# EAGLE schematic vr98-north-revA (EAGLE 9.6.2)

## Sheet 1 of 3
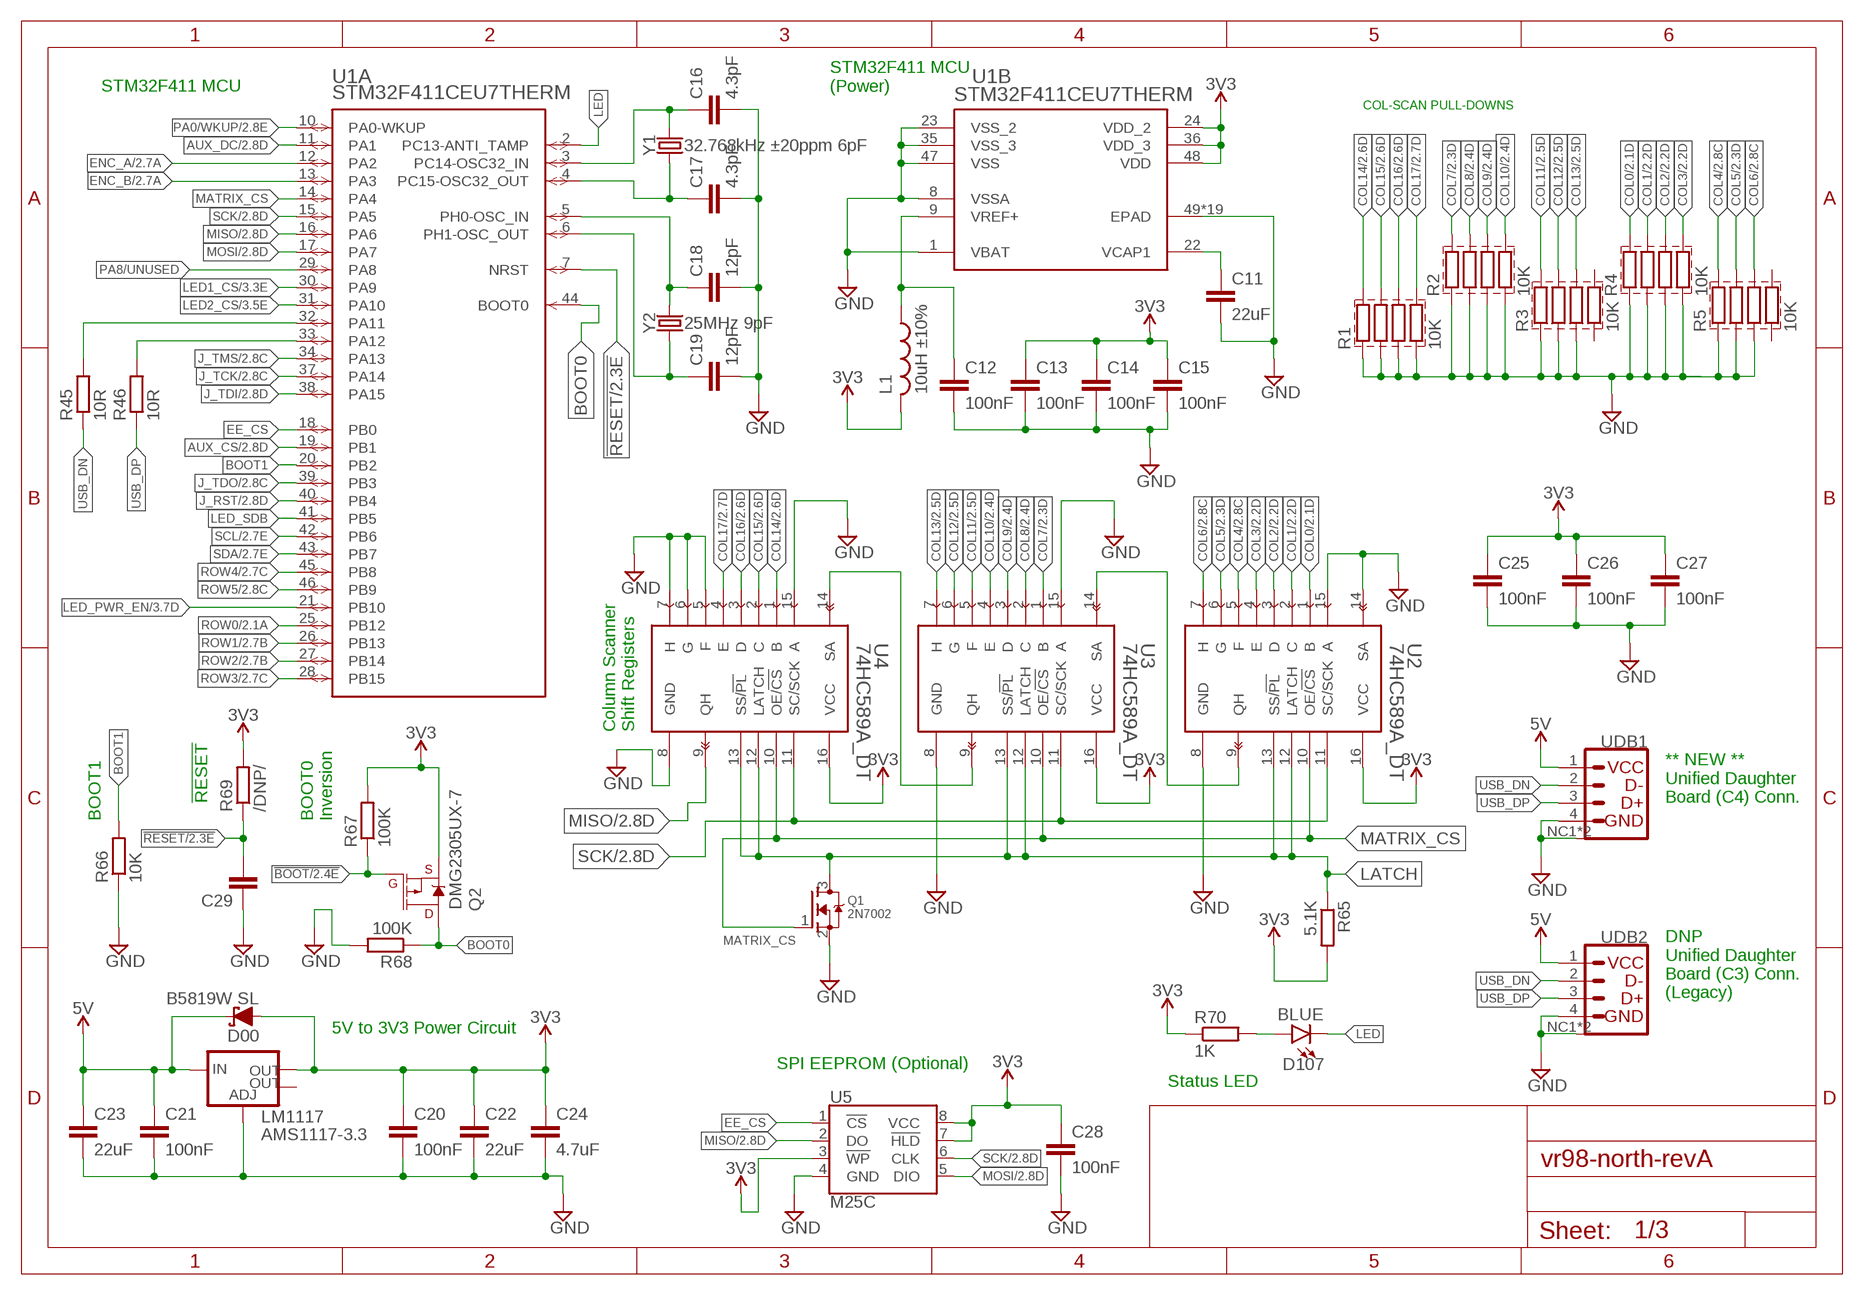
[diagram p0: schematic, sheet 1]

### Parts
C11  22uF  C-EUC0603  [C0603]
C12  100nF  C-EUC0603  [C0603]
C13  100nF  C-EUC0603  [C0603]
C14  100nF  C-EUC0603  [C0603]
C15  100nF  C-EUC0603  [C0603]
C16  4.3pF  C-EUC0603  [C0603]
C17  4.3pF  C-EUC0603  [C0603]
C18  12pF  C-EUC0603  [C0603]
C19  12pF  C-EUC0603  [C0603]
C20  100nF  0.1UF-0603-25V-5%  [0603]
C21  100nF  0.1UF-0603-25V-5%  [0603]
C22  22uF  0.22UF-0603-25V-10%  [0603]
C23  22uF  0.22UF-0603-25V-10%  [0603]
C24  4.7uF  1.0NF/1000PF-0603-50V-10%  [0603]
C25  100nF  0.1UF-0603-25V-5%  [0603]
C26  100nF  0.1UF-0603-25V-5%  [0603]
C27  100nF  0.1UF-0603-25V-5%  [0603]
C28  100nF  0.1UF-0603-25V-5%  [0603]
C29  C-EUC0603  [C0603]
D00  B5819W SL  1N5819WS  [SOD-123]
D107  BLUE  LED-BLUE0603  [LED-0603]
L1  10uH ±10%  L-USL3225M  [L3225M]
LM1117  AMS1117-3.3  V_REG_LM1117SOT223  [SOT223]
Q1  2N7002  MOSFET-NREFLOW  [SOT23]
Q2  DMG2305UX-7  MOSFET_PCH-DMG2305UX-7  [SOT23-3]
R1  10K  R-EU-4  [R0603X4]
R2  10K  R-EU-4  [R0603X4]
R3  10K  R-EU-4  [R0603X4]
R4  10K  R-EU-4  [R0603X4]
R5  10K  R-EU-4  [R0603X4]
R45  10R  R-EU_R0603  [R0603]
R46  10R  R-EU_R0603  [R0603]
R65  5.1K  R-EU_R0603  [R0603]
R66  10K  R-EU_R0603  [R0603]
R67  100K  R-EU_R0603  [R0603]
R68  100K  R-EU_R0603  [R0603]
R69  /DNP/  R-EU_R0603  [R0603]
R70  1K  R-EU_R0603  [R0603]
U1  STM32F411CEU7THERM  [UFQFPN-48_7X7X0P55MM-THERM]
U2  74HC589A_DT  [TSSOP16]
U3  74HC589A_DT  [TSSOP16]
U4  74HC589A_DT  [TSSOP16]
U5  M25C  [8-SOIC]
UDB1  UBD-S1_C4  [MOLEX_781710004]
UDB2  UBD-C3  [JST_SM04B-SRSS-TB_LF_SN]
Y1  32.768kHz ±20ppm 6pF  CRYSTAL-32.768KHZSMD-3.2X1.5  [CRYSTAL-SMD-3.2X1.5MM]
Y2  25MHz 9pF  CRYSTAL-24MHZ"  [CRYSTAL-SMD-5X3.2-4PAD]

### Nets
!BOOT: Q2.1(G) R67.1 ; also sheet 2
!RESET: C29.2 R69.1 U1.7(A:NRST) ; also sheet 2
AUX_CS: U1.19(A:PB1) ; also sheet 2
AUX_DC: U1.11(A:PA1) ; also sheet 2
BOOT0: Q2.3(D) R68.1 U1.44(A:BOOT0)
BOOT1: R66.2 U1.20(A:PB2)
COL0: R4.8 U2.1(B) ; also sheet 2
COL1: R4.7 U2.2(C) ; also sheet 2
COL2: R4.6 U2.3(D) ; also sheet 2
COL3: R4.5 U2.4(E) ; also sheet 2
COL4: R5.8 U2.5(F) ; also sheet 2
COL5: R5.7 U2.6(G) ; also sheet 2
COL6: R5.6 U2.7(H) ; also sheet 2
COL7: R2.8 U3.1(B) ; also sheet 2
COL8: R2.7 U3.2(C) ; also sheet 2
COL9: R2.6 U3.3(D) ; also sheet 2
COL10: R2.5 U3.4(E) ; also sheet 2
COL11: R3.8 U3.5(F) ; also sheet 2
COL12: R3.7 U3.6(G) ; also sheet 2
COL13: R3.6 U3.7(H) ; also sheet 2
COL14: R1.8 U4.1(B) ; also sheet 2
COL15: R1.7 U4.2(C) ; also sheet 2
COL16: R1.6 U4.3(D) ; also sheet 2
COL17: R1.5 U4.4(E) ; also sheet 2
EE_CS: U1.18(A:PB0) U5.1(!CS)
ENC_A: U1.12(A:PA2) ; also sheet 2
ENC_B: U1.13(A:PA3) ; also sheet 2
GND: C11.2 C12.2 C13.2 C14.2 C15.2 C16.2 C17.2 C18.2 C19.2 C20.2 C21.2 C22.2 C23.2 C24.2 C25.2 C26.2 C27.2 C28.2 C29.1 LM1117.1(ADJ) R66.1 R68.2 U1.1(B:VBAT) U1.8(B:VSSA) U1.23(B:VSS_2) U1.35(B:VSS_3) U1.47(B:VSS) U1.49(B:EPAD) U1.49@1(B:EPAD) U1.49@2(B:EPAD) U1.49@3(B:EPAD) U1.49@4(B:EPAD) U1.49@5(B:EPAD) U1.49@6(B:EPAD) U1.49@7(B:EPAD) U1.49@8(B:EPAD) U1.49@9(B:EPAD) U1.49@10(B:EPAD) U1.49@11(B:EPAD) U1.49@12(B:EPAD) U1.49@13(B:EPAD) U1.49@14(B:EPAD) U1.49@15(B:EPAD) U1.49@16(B:EPAD) U1.49@17(B:EPAD) U1.49@18(B:EPAD) U2.8(GND) U2.14(SA) U2.15(A) U3.8(GND) U3.15(A) U4.5(F) U4.6(G) U4.7(H) U4.8(GND) U4.15(A) U5.4(GND) UDB1.4(GND) UDB1.NC1(M) UDB1.NC2(M) UDB2.4(GND) UDB2.NC1(M) UDB2.NC2(M) ; also sheet 2,3
GND2: R1.1 R1.2 R1.3 R1.4 R2.1 R2.2 R2.3 R2.4 R3.1 R3.2 R3.3 R4.1 R4.2 R4.3 R4.4 R5.1 R5.2 R5.3 ; supply symbol labelled GND
J_RST: U1.40(A:PB4) ; also sheet 2
J_TCK: U1.37(A:PA14) ; also sheet 2
J_TDI: U1.38(A:PA15) ; also sheet 2
J_TDO: U1.39(A:PB3) ; also sheet 2
J_TMS: U1.34(A:PA13) ; also sheet 2
LATCH: Q1.3(D) R65.1 U2.12(LATCH) U2.13(SS/!PL) U3.12(LATCH) U3.13(SS/!PL) U4.12(LATCH) U4.13(SS/!PL)
LED: D107.C U1.2(A:PC13-ANTI_TAMP)
LED1_CS: U1.30(A:PA9) ; also sheet 3
LED2_CS: U1.31(A:PA10) ; also sheet 3
LED_PWR_EN: U1.21(A:PB10) ; also sheet 3
LED_SDB: U1.41(A:PB5)
MATRIX_CS: Q1.1(G) U1.14(A:PA4) U2.10(OE/!CS) U3.10(OE/!CS) U4.10(OE/!CS)
MISO: U1.16(A:PA6) U4.9(QH) U5.2(DO) ; also sheet 2,3
MOSI: U1.17(A:PA7) U5.5(DIO) ; also sheet 2,3
N$54: Q1.2(S) ; supply symbol labelled GND
N$75: C11.1 U1.22(B:VCAP1)
N$140: R45.2 U1.32(A:PA11)
N$141: R46.2 U1.33(A:PA12)
N$145: D107.A R70.2
N$149: U3.9(QH) U4.14(SA)
N$162: U2.9(QH) U3.14(SA)
PA0/WKUP: U1.10(A:PA0-WKUP) ; also sheet 2
PA8/UNUSED: U1.29(A:PA8)
ROW0: U1.25(A:PB12) ; also sheet 2
ROW1: U1.26(A:PB13) ; also sheet 2
ROW2: U1.27(A:PB14) ; also sheet 2
ROW3: U1.28(A:PB15) ; also sheet 2
ROW4: U1.45(A:PB8) ; also sheet 2
ROW5: U1.46(A:PB9) ; also sheet 2
SCK: U1.15(A:PA5) U2.11(SC/SCK) U3.11(SC/SCK) U4.11(SC/SCK) U5.6(CLK) ; also sheet 2,3
SCL: U1.42(A:PB6) ; also sheet 2,3
SDA: U1.43(A:PB7) ; also sheet 2,3
USB_DN: R45.1 UDB1.2(DN) UDB2.2(DN)
USB_DP: R46.1 UDB1.3(DP) UDB2.3(DP)
VCC_1: C21.1 C23.1 D00.C LM1117.3(IN) UDB1.1(VCC) UDB2.1(VCC) ; supply symbol labelled 5V ; also sheet 2,3
VCC_2: C13.1 C14.1 C15.1 C20.1 C22.1 C24.1 C25.1 C26.1 C27.1 C28.1 D00.A L1.2 LM1117.2(OUT) Q2.2(S) R65.2 R67.2 R69.2 R70.1 U1.24(B:VDD_2) U1.36(B:VDD_3) U1.48(B:VDD) U2.16(VCC) U3.16(VCC) U4.16(VCC) U5.3(!WP) U5.7(!HLD) U5.8(VCC) ; supply symbol labelled 3V3 ; also sheet 2,3
VREF+: C12.1 L1.1 U1.9(B:VREF+)
Y1I: C16.1 U1.3(A:PC14-OSC32_IN) Y1.P$2
Y1O: C17.1 U1.4(A:PC15-OSC32_OUT) Y1.P$1
Y2I: C18.1 U1.5(A:PH0-OSC_IN) Y2.3
Y2O: C19.1 U1.6(A:PH1-OSC_OUT) Y2.1
Unconnected: LM1117.4(OUT) R3.4 R3.5 R5.4 R5.5

### Notes on the sheet
- STM32F411 MCU
- STM32F411 MCU
  (Power)
- COL-SCAN PULL-DOWNS
- Column Scanner
  Shift Registers
- !RESET
- ** NEW **
  Unified Daughter
  Board (C4) Conn.
- BOOT1
- BOOT0
  Inversion
- DNP
  Unified Daughter
  Board (C3) Conn.
  (Legacy)
- 5V to 3V3 Power Circuit
- SPI EEPROM (Optional)
- Status LED

## Sheet 2 of 3
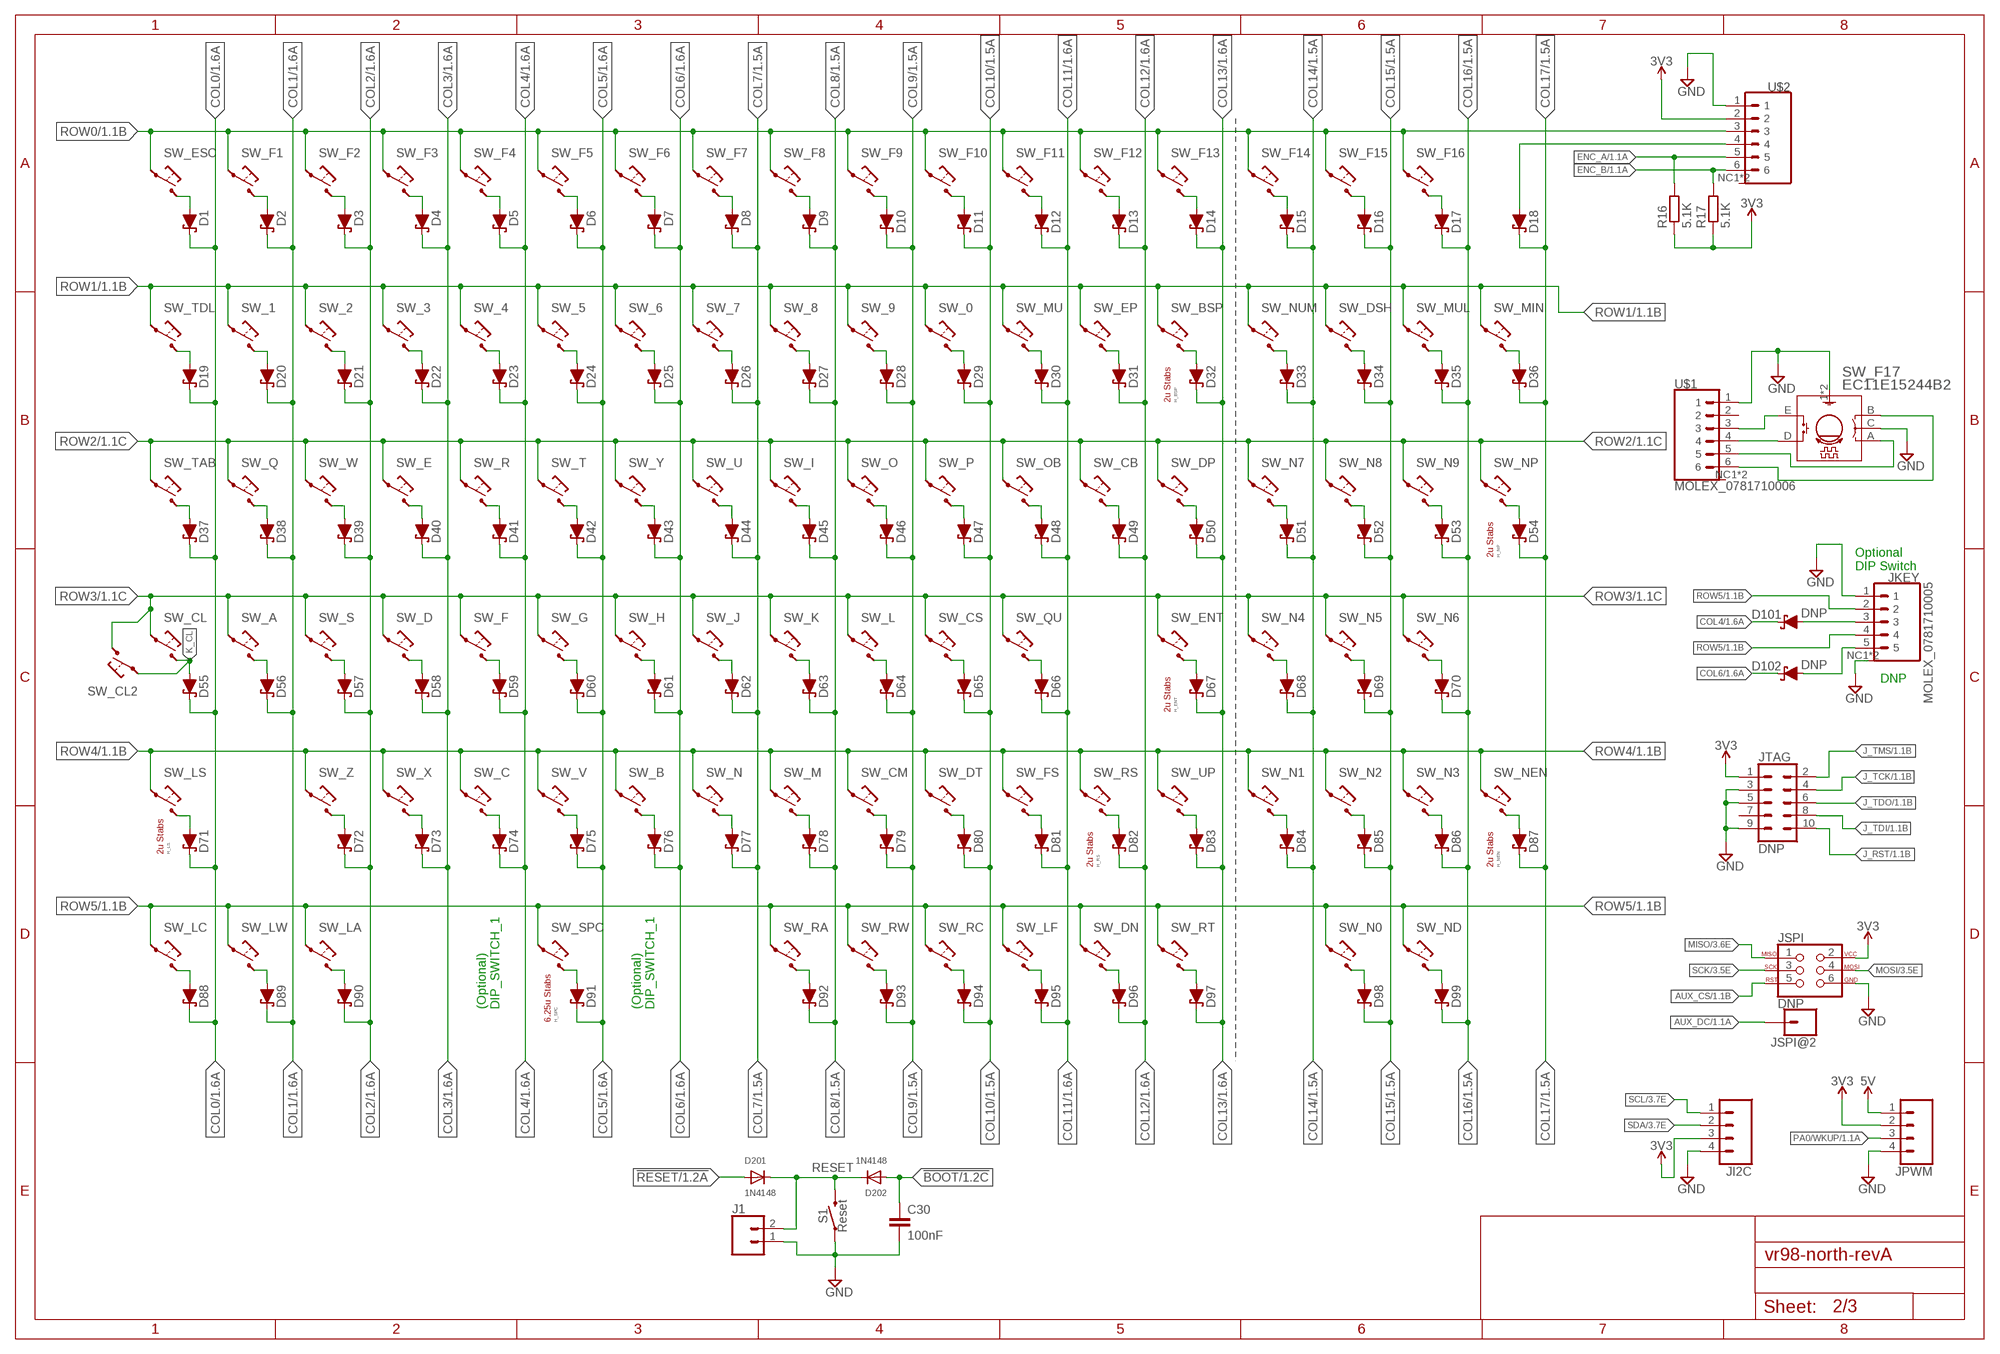
[diagram p1: schematic, sheet 2]

### Parts
C30  100nF  C-EUC0805  [C0805]
D1  1N5819WS  [SOD-123]
D2  1N5819WS  [SOD-123]
D3  1N5819WS  [SOD-123]
D4  1N5819WS  [SOD-123]
D5  1N5819WS  [SOD-123]
D6  1N5819WS  [SOD-123]
D7  1N5819WS  [SOD-123]
D8  1N5819WS  [SOD-123]
D9  1N5819WS  [SOD-123]
D10  1N5819WS  [SOD-123]
D11  1N5819WS  [SOD-123]
D12  1N5819WS  [SOD-123]
D13  1N5819WS  [SOD-123]
D14  1N5819WS  [SOD-123]
D15  1N5819WS  [SOD-123]
D16  1N5819WS  [SOD-123]
D17  1N5819WS  [SOD-123]
D18  1N5819WS  [SOD-123]
D19  1N5819WS  [SOD-123]
D20  1N5819WS  [SOD-123]
D21  1N5819WS  [SOD-123]
D22  1N5819WS  [SOD-123]
D23  1N5819WS  [SOD-123]
D24  1N5819WS  [SOD-123]
D25  1N5819WS  [SOD-123]
D26  1N5819WS  [SOD-123]
D27  1N5819WS  [SOD-123]
D28  1N5819WS  [SOD-123]
D29  1N5819WS  [SOD-123]
D30  1N5819WS  [SOD-123]
D31  1N5819WS  [SOD-123]
D32  1N5819WS  [SOD-123]
D33  1N5819WS  [SOD-123]
D34  1N5819WS  [SOD-123]
D35  1N5819WS  [SOD-123]
D36  1N5819WS  [SOD-123]
D37  1N5819WS  [SOD-123]
D38  1N5819WS  [SOD-123]
D39  1N5819WS  [SOD-123]
D40  1N5819WS  [SOD-123]
D41  1N5819WS  [SOD-123]
D42  1N5819WS  [SOD-123]
D43  1N5819WS  [SOD-123]
D44  1N5819WS  [SOD-123]
D45  1N5819WS  [SOD-123]
D46  1N5819WS  [SOD-123]
D47  1N5819WS  [SOD-123]
D48  1N5819WS  [SOD-123]
D49  1N5819WS  [SOD-123]
D50  1N5819WS  [SOD-123]
D51  1N5819WS  [SOD-123]
D52  1N5819WS  [SOD-123]
D53  1N5819WS  [SOD-123]
D54  1N5819WS  [SOD-123]
D55  1N5819WS  [SOD-123]
D56  1N5819WS  [SOD-123]
D57  1N5819WS  [SOD-123]
D58  1N5819WS  [SOD-123]
D59  1N5819WS  [SOD-123]
D60  1N5819WS  [SOD-123]
D61  1N5819WS  [SOD-123]
D62  1N5819WS  [SOD-123]
D63  1N5819WS  [SOD-123]
D64  1N5819WS  [SOD-123]
D65  1N5819WS  [SOD-123]
D66  1N5819WS  [SOD-123]
D67  1N5819WS  [SOD-123]
D68  1N5819WS  [SOD-123]
D69  1N5819WS  [SOD-123]
D70  1N5819WS  [SOD-123]
D71  1N5819WS  [SOD-123]
D72  1N5819WS  [SOD-123]
D73  1N5819WS  [SOD-123]
D74  1N5819WS  [SOD-123]
D75  1N5819WS  [SOD-123]
D76  1N5819WS  [SOD-123]
D77  1N5819WS  [SOD-123]
D78  1N5819WS  [SOD-123]
D79  1N5819WS  [SOD-123]
D80  1N5819WS  [SOD-123]
D81  1N5819WS  [SOD-123]
D82  1N5819WS  [SOD-123]
D83  1N5819WS  [SOD-123]
D84  1N5819WS  [SOD-123]
D85  1N5819WS  [SOD-123]
D86  1N5819WS  [SOD-123]
D87  1N5819WS  [SOD-123]
D88  1N5819WS  [SOD-123]
D89  1N5819WS  [SOD-123]
D90  1N5819WS  [SOD-123]
D91  1N5819WS  [SOD-123]
D92  1N5819WS  [SOD-123]
D93  1N5819WS  [SOD-123]
D94  1N5819WS  [SOD-123]
D95  1N5819WS  [SOD-123]
D96  1N5819WS  [SOD-123]
D97  1N5819WS  [SOD-123]
D98  1N5819WS  [SOD-123]
D99  1N5819WS  [SOD-123]
D101  DNP  1N5819WS  [SOD-123]
D102  DNP  1N5819WS  [SOD-123]
D201  1N4148  DIODESOT23_REFLOW  [SOT23-R]
D202  1N4148  DIODESOT23_REFLOW  [SOT23-R]
H_BSP  MX-STABS-200U  [MX-STABS-200U]
H_ENT  MX-STABS-200U  [MX-STABS-200U]
H_LS  MX-STABS-200U  [MX-STABS-200U]
H_NEN  MX-STABS-200U  [MX-STABS-200U]
H_NP  MX-STABS-200U  [MX-STABS-200U]
H_RS  MX-STABS-200U  [MX-STABS-200U]
H_SPC  MX-STABS-625U  [MX-STABS-625U]
J1  CONN_02  [1X02]
JI2C  CONN_04  [1X04]
JKEY  MOLEX_0781710005  [MOLEX_781710005]
JPWM  CONN_04  [1X04]
JSPI  DNP  AVR_SPI_PROG_3X2NS  [2X3-NS]
JSPI@2  CONN_01  [1X01]
JTAG  DNP  CONN_05X2NO_SILK  [2X5_NOSILK]
R16  5.1K  R-EU_R0603  [R0603]
R17  5.1K  R-EU_R0603  [R0603]
S1  Reset  MOMENTARY-SWITCH-SPST-SMD-5.2-TALL-REDUNDANT  [TACTILE_SWITCH_SMD_5.2MM]
SW_0  MX-5-PIN-HOTSWAP-PAD  [MX-5-PIN-HOTSWAP-PAD]
SW_1  MX-5-PIN-HOTSWAP-PAD  [MX-5-PIN-HOTSWAP-PAD]
SW_2  MX-5-PIN-HOTSWAP-PAD  [MX-5-PIN-HOTSWAP-PAD]
SW_3  MX-5-PIN-HOTSWAP-PAD  [MX-5-PIN-HOTSWAP-PAD]
SW_4  MX-5-PIN-HOTSWAP-PAD  [MX-5-PIN-HOTSWAP-PAD]
SW_5  MX-5-PIN-HOTSWAP-PAD  [MX-5-PIN-HOTSWAP-PAD]
SW_6  MX-5-PIN-HOTSWAP-PAD  [MX-5-PIN-HOTSWAP-PAD]
SW_7  MX-5-PIN-HOTSWAP-PAD  [MX-5-PIN-HOTSWAP-PAD]
SW_8  MX-5-PIN-HOTSWAP-PAD  [MX-5-PIN-HOTSWAP-PAD]
SW_9  MX-5-PIN-HOTSWAP-PAD  [MX-5-PIN-HOTSWAP-PAD]
SW_A  MX-5-PIN-HOTSWAP-PAD  [MX-5-PIN-HOTSWAP-PAD]
SW_B  MX-5-PIN-HOTSWAP-PAD  [MX-5-PIN-HOTSWAP-PAD]
SW_BSP  MX-5-PIN-HOTSWAP-PAD  [MX-5-PIN-HOTSWAP-PAD]
SW_C  MX-5-PIN-HOTSWAP-PAD  [MX-5-PIN-HOTSWAP-PAD]
SW_CB  MX-5-PIN-HOTSWAP-PAD  [MX-5-PIN-HOTSWAP-PAD]
SW_CL  MX-5-PIN-HOTSWAP-PAD  [MX-5-PIN-HOTSWAP-PAD]
SW_CL2  MX-5-PIN-MILMAX-3305-XNO-SILK  [MX-5-PIN-MILMAX-3305-X-NS]
SW_CM  MX-5-PIN-HOTSWAP-PAD  [MX-5-PIN-HOTSWAP-PAD]
SW_CS  MX-5-PIN-HOTSWAP-PAD  [MX-5-PIN-HOTSWAP-PAD]
SW_D  MX-5-PIN-HOTSWAP-PAD  [MX-5-PIN-HOTSWAP-PAD]
SW_DN  MX-5-PIN-HOTSWAP-PAD  [MX-5-PIN-HOTSWAP-PAD]
SW_DP  MX-5-PIN-HOTSWAP-PAD  [MX-5-PIN-HOTSWAP-PAD]
SW_DSH  MX-5-PIN-HOTSWAP-PAD  [MX-5-PIN-HOTSWAP-PAD]
SW_DT  MX-5-PIN-HOTSWAP-PAD  [MX-5-PIN-HOTSWAP-PAD]
SW_E  MX-5-PIN-HOTSWAP-PAD  [MX-5-PIN-HOTSWAP-PAD]
SW_ENT  MX-5-PIN-HOTSWAP-PAD  [MX-5-PIN-HOTSWAP-PAD]
SW_EP  MX-5-PIN-HOTSWAP-PAD  [MX-5-PIN-HOTSWAP-PAD]
SW_ESC  MX-5-PIN-HOTSWAP-PAD  [MX-5-PIN-HOTSWAP-PAD]
SW_F  MX-5-PIN-HOTSWAP-PAD  [MX-5-PIN-HOTSWAP-PAD]
SW_F1  MX-5-PIN-HOTSWAP-PAD  [MX-5-PIN-HOTSWAP-PAD]
SW_F2  MX-5-PIN-HOTSWAP-PAD  [MX-5-PIN-HOTSWAP-PAD]
SW_F3  MX-5-PIN-HOTSWAP-PAD  [MX-5-PIN-HOTSWAP-PAD]
SW_F4  MX-5-PIN-HOTSWAP-PAD  [MX-5-PIN-HOTSWAP-PAD]
SW_F5  MX-5-PIN-HOTSWAP-PAD  [MX-5-PIN-HOTSWAP-PAD]
SW_F6  MX-5-PIN-HOTSWAP-PAD  [MX-5-PIN-HOTSWAP-PAD]
SW_F7  MX-5-PIN-HOTSWAP-PAD  [MX-5-PIN-HOTSWAP-PAD]
SW_F8  MX-5-PIN-HOTSWAP-PAD  [MX-5-PIN-HOTSWAP-PAD]
SW_F9  MX-5-PIN-HOTSWAP-PAD  [MX-5-PIN-HOTSWAP-PAD]
SW_F10  MX-5-PIN-HOTSWAP-PAD  [MX-5-PIN-HOTSWAP-PAD]
SW_F11  MX-5-PIN-HOTSWAP-PAD  [MX-5-PIN-HOTSWAP-PAD]
SW_F12  MX-5-PIN-HOTSWAP-PAD  [MX-5-PIN-HOTSWAP-PAD]
SW_F13  MX-5-PIN-HOTSWAP-PAD  [MX-5-PIN-HOTSWAP-PAD]
SW_F14  MX-5-PIN-HOTSWAP-PAD  [MX-5-PIN-HOTSWAP-PAD]
SW_F15  MX-5-PIN-HOTSWAP-PAD  [MX-5-PIN-HOTSWAP-PAD]
SW_F16  MX-5-PIN-HOTSWAP-PAD  [MX-5-PIN-HOTSWAP-PAD]
SW_F17  EC11E15244B2  [ROTARY_EC11E]
SW_FS  MX-5-PIN-HOTSWAP-PAD  [MX-5-PIN-HOTSWAP-PAD]
SW_G  MX-5-PIN-HOTSWAP-PAD  [MX-5-PIN-HOTSWAP-PAD]
SW_H  MX-5-PIN-HOTSWAP-PAD  [MX-5-PIN-HOTSWAP-PAD]
SW_I  MX-5-PIN-HOTSWAP-PAD  [MX-5-PIN-HOTSWAP-PAD]
SW_J  MX-5-PIN-HOTSWAP-PAD  [MX-5-PIN-HOTSWAP-PAD]
SW_K  MX-5-PIN-HOTSWAP-PAD  [MX-5-PIN-HOTSWAP-PAD]
SW_L  MX-5-PIN-HOTSWAP-PAD  [MX-5-PIN-HOTSWAP-PAD]
SW_LA  MX-5-PIN-HOTSWAP-PAD  [MX-5-PIN-HOTSWAP-PAD]
SW_LC  MX-5-PIN-HOTSWAP-PAD  [MX-5-PIN-HOTSWAP-PAD]
SW_LF  MX-5-PIN-HOTSWAP-PAD  [MX-5-PIN-HOTSWAP-PAD]
SW_LS  MX-5-PIN-HOTSWAP-PAD  [MX-5-PIN-HOTSWAP-PAD]
SW_LW  MX-5-PIN-HOTSWAP-PAD  [MX-5-PIN-HOTSWAP-PAD]
SW_M  MX-5-PIN-HOTSWAP-PAD  [MX-5-PIN-HOTSWAP-PAD]
SW_MIN  MX-5-PIN-HOTSWAP-PAD  [MX-5-PIN-HOTSWAP-PAD]
SW_MU  MX-5-PIN-HOTSWAP-PAD  [MX-5-PIN-HOTSWAP-PAD]
SW_MUL  MX-5-PIN-HOTSWAP-PAD  [MX-5-PIN-HOTSWAP-PAD]
SW_N  MX-5-PIN-HOTSWAP-PAD  [MX-5-PIN-HOTSWAP-PAD]
SW_N0  MX-5-PIN-HOTSWAP-PAD  [MX-5-PIN-HOTSWAP-PAD]
SW_N1  MX-5-PIN-HOTSWAP-PAD  [MX-5-PIN-HOTSWAP-PAD]
SW_N2  MX-5-PIN-HOTSWAP-PAD  [MX-5-PIN-HOTSWAP-PAD]
SW_N3  MX-5-PIN-HOTSWAP-PAD  [MX-5-PIN-HOTSWAP-PAD]
SW_N4  MX-5-PIN-HOTSWAP-PAD  [MX-5-PIN-HOTSWAP-PAD]
SW_N5  MX-5-PIN-HOTSWAP-PAD  [MX-5-PIN-HOTSWAP-PAD]
SW_N6  MX-5-PIN-HOTSWAP-PAD  [MX-5-PIN-HOTSWAP-PAD]
SW_N7  MX-5-PIN-HOTSWAP-PAD  [MX-5-PIN-HOTSWAP-PAD]
SW_N8  MX-5-PIN-HOTSWAP-PAD  [MX-5-PIN-HOTSWAP-PAD]
SW_N9  MX-5-PIN-HOTSWAP-PAD  [MX-5-PIN-HOTSWAP-PAD]
SW_ND  MX-5-PIN-HOTSWAP-PAD  [MX-5-PIN-HOTSWAP-PAD]
SW_NEN  MX-5-PIN-HOTSWAP-PAD  [MX-5-PIN-HOTSWAP-PAD]
SW_NP  MX-5-PIN-HOTSWAP-PAD  [MX-5-PIN-HOTSWAP-PAD]
SW_NUM  MX-5-PIN-HOTSWAP-PAD  [MX-5-PIN-HOTSWAP-PAD]
SW_O  MX-5-PIN-HOTSWAP-PAD  [MX-5-PIN-HOTSWAP-PAD]
SW_OB  MX-5-PIN-HOTSWAP-PAD  [MX-5-PIN-HOTSWAP-PAD]
SW_P  MX-5-PIN-HOTSWAP-PAD  [MX-5-PIN-HOTSWAP-PAD]
SW_Q  MX-5-PIN-HOTSWAP-PAD  [MX-5-PIN-HOTSWAP-PAD]
SW_QU  MX-5-PIN-HOTSWAP-PAD  [MX-5-PIN-HOTSWAP-PAD]
SW_R  MX-5-PIN-HOTSWAP-PAD  [MX-5-PIN-HOTSWAP-PAD]
SW_RA  MX-5-PIN-HOTSWAP-PAD  [MX-5-PIN-HOTSWAP-PAD]
SW_RC  MX-5-PIN-HOTSWAP-PAD  [MX-5-PIN-HOTSWAP-PAD]
SW_RS  MX-5-PIN-HOTSWAP-PAD  [MX-5-PIN-HOTSWAP-PAD]
SW_RT  MX-5-PIN-HOTSWAP-PAD  [MX-5-PIN-HOTSWAP-PAD]
SW_RW  MX-5-PIN-HOTSWAP-PAD  [MX-5-PIN-HOTSWAP-PAD]
SW_S  MX-5-PIN-HOTSWAP-PAD  [MX-5-PIN-HOTSWAP-PAD]
SW_SPC  MX-5-PIN-HOTSWAP-PAD  [MX-5-PIN-HOTSWAP-PAD]
SW_T  MX-5-PIN-HOTSWAP-PAD  [MX-5-PIN-HOTSWAP-PAD]
SW_TAB  MX-5-PIN-HOTSWAP-PAD  [MX-5-PIN-HOTSWAP-PAD]
SW_TDL  MX-5-PIN-HOTSWAP-PAD  [MX-5-PIN-HOTSWAP-PAD]
SW_U  MX-5-PIN-HOTSWAP-PAD  [MX-5-PIN-HOTSWAP-PAD]
SW_UP  MX-5-PIN-HOTSWAP-PAD  [MX-5-PIN-HOTSWAP-PAD]
SW_V  MX-5-PIN-HOTSWAP-PAD  [MX-5-PIN-HOTSWAP-PAD]
SW_W  MX-5-PIN-HOTSWAP-PAD  [MX-5-PIN-HOTSWAP-PAD]
SW_X  MX-5-PIN-HOTSWAP-PAD  [MX-5-PIN-HOTSWAP-PAD]
SW_Y  MX-5-PIN-HOTSWAP-PAD  [MX-5-PIN-HOTSWAP-PAD]
SW_Z  MX-5-PIN-HOTSWAP-PAD  [MX-5-PIN-HOTSWAP-PAD]
U$1  MOLEX_0781710006  [MOLEX_781710006]
U$2  MOLEX_0781710006  [MOLEX_781710006]

### Nets
!BOOT: C30.1 D202.1(A) ; also sheet 1
!RESET: D201.1(A) ; also sheet 1
AUX_CS: JSPI.5 ; also sheet 1
AUX_DC: JSPI@2.1 ; also sheet 1
COL0: D1.C D19.C D37.C D55.C D71.C D88.C ; also sheet 1
COL1: D2.C D20.C D38.C D56.C D89.C ; also sheet 1
COL2: D3.C D21.C D39.C D57.C D72.C D90.C ; also sheet 1
COL3: D4.C D22.C D40.C D58.C D73.C ; also sheet 1
COL4: D5.C D23.C D41.C D59.C D74.C D101.C ; also sheet 1
COL5: D6.C D24.C D42.C D60.C D75.C D91.C ; also sheet 1
COL6: D7.C D25.C D43.C D61.C D76.C D102.C ; also sheet 1
COL7: D8.C D26.C D44.C D62.C D77.C ; also sheet 1
COL8: D9.C D27.C D45.C D63.C D78.C D92.C ; also sheet 1
COL9: D10.C D28.C D46.C D64.C D79.C D93.C ; also sheet 1
COL10: D11.C D29.C D47.C D65.C D80.C D94.C ; also sheet 1
COL11: D12.C D30.C D48.C D66.C D81.C D95.C ; also sheet 1
COL12: D13.C D31.C D49.C D82.C D96.C ; also sheet 1
COL13: D14.C D32.C D50.C D67.C D83.C D97.C ; also sheet 1
COL14: D15.C D33.C D51.C D68.C D84.C ; also sheet 1
COL15: D16.C D34.C D52.C D69.C D85.C D98.C ; also sheet 1
COL16: D17.C D35.C D53.C D70.C D86.C D99.C ; also sheet 1
COL17: D18.C D36.C D54.C D87.C ; also sheet 1
ENC_A: R16.2 U$2.5 ; also sheet 1
ENC_B: R17.2 U$2.6 ; also sheet 1
GND: C30.2 J1.1 JI2C.4 JKEY.1 JKEY.NC1(M) JKEY.NC2(M) JPWM.4 JSPI.6 JTAG.3 JTAG.5 JTAG.9 S1.1 S1.2 SW_F17.1(GND) SW_F17.2(GND) U$1.1 U$2.1 ; also sheet 1,3
J_RST: JTAG.10 ; also sheet 1
J_TCK: JTAG.4 ; also sheet 1
J_TDI: JTAG.8 ; also sheet 1
J_TDO: JTAG.6 ; also sheet 1
J_TMS: JTAG.2 ; also sheet 1
K_BSP: D32.A SW_BSP.1@1(P) SW_BSP.1@2(P)
K_CL: D55.A SW_CL2.2(S) SW_CL.1@1(P) SW_CL.1@2(P)
K_DP: D50.A SW_DP.1@1(P) SW_DP.1@2(P)
K_ENT: D67.A SW_ENT.1@1(P) SW_ENT.1@2(P)
K_LS: D71.A SW_LS.1@1(P) SW_LS.1@2(P)
MISO: JSPI.1 ; also sheet 1,3
MOSI: JSPI.4 ; also sheet 1,3
N$2: D70.A SW_N6.1@1(P) SW_N6.1@2(P)
N$25: D1.A SW_ESC.1@1(P) SW_ESC.1@2(P)
N$26: D2.A SW_F1.1@1(P) SW_F1.1@2(P)
N$27: D3.A SW_F2.1@1(P) SW_F2.1@2(P)
N$28: D4.A SW_F3.1@1(P) SW_F3.1@2(P)
N$29: D5.A SW_F4.1@1(P) SW_F4.1@2(P)
N$30: D6.A SW_F5.1@1(P) SW_F5.1@2(P)
N$31: D7.A SW_F6.1@1(P) SW_F6.1@2(P)
N$32: D8.A SW_F7.1@1(P) SW_F7.1@2(P)
N$33: D9.A SW_F8.1@1(P) SW_F8.1@2(P)
N$34: D10.A SW_F9.1@1(P) SW_F9.1@2(P)
N$35: D11.A SW_F10.1@1(P) SW_F10.1@2(P)
N$36: D12.A SW_F11.1@1(P) SW_F11.1@2(P)
N$37: D13.A SW_F12.1@1(P) SW_F12.1@2(P)
N$38: D14.A SW_F13.1@1(P) SW_F13.1@2(P)
N$39: D15.A SW_F14.1@1(P) SW_F14.1@2(P)
N$40: D16.A SW_F15.1@1(P) SW_F15.1@2(P)
N$41: D19.A SW_TDL.1@1(P) SW_TDL.1@2(P)
N$42: D20.A SW_1.1@1(P) SW_1.1@2(P)
N$43: D21.A SW_2.1@1(P) SW_2.1@2(P)
N$44: D22.A SW_3.1@1(P) SW_3.1@2(P)
N$45: D23.A SW_4.1@1(P) SW_4.1@2(P)
N$46: D24.A SW_5.1@1(P) SW_5.1@2(P)
N$47: D25.A SW_6.1@1(P) SW_6.1@2(P)
N$48: D26.A SW_7.1@1(P) SW_7.1@2(P)
N$49: D27.A SW_8.1@1(P) SW_8.1@2(P)
N$50: D28.A SW_9.1@1(P) SW_9.1@2(P)
N$51: D29.A SW_0.1@1(P) SW_0.1@2(P)
N$52: D30.A SW_MU.1@1(P) SW_MU.1@2(P)
N$53: D31.A SW_EP.1@1(P) SW_EP.1@2(P)
N$55: D33.A SW_NUM.1@1(P) SW_NUM.1@2(P)
N$56: D34.A SW_DSH.1@1(P) SW_DSH.1@2(P)
N$57: D38.A SW_Q.1@1(P) SW_Q.1@2(P)
N$58: D37.A SW_TAB.1@1(P) SW_TAB.1@2(P)
N$59: D39.A SW_W.1@1(P) SW_W.1@2(P)
N$60: D40.A SW_E.1@1(P) SW_E.1@2(P)
N$61: D41.A SW_R.1@1(P) SW_R.1@2(P)
N$62: D42.A SW_T.1@1(P) SW_T.1@2(P)
N$63: D43.A SW_Y.1@1(P) SW_Y.1@2(P)
N$64: D44.A SW_U.1@1(P) SW_U.1@2(P)
N$65: D45.A SW_I.1@1(P) SW_I.1@2(P)
N$66: D46.A SW_O.1@1(P) SW_O.1@2(P)
N$67: D47.A SW_P.1@1(P) SW_P.1@2(P)
N$68: D48.A SW_OB.1@1(P) SW_OB.1@2(P)
N$69: D49.A SW_CB.1@1(P) SW_CB.1@2(P)
N$71: D51.A SW_N7.1@1(P) SW_N7.1@2(P)
N$72: D52.A SW_N8.1@1(P) SW_N8.1@2(P)
N$73: D69.A SW_N5.1@1(P) SW_N5.1@2(P)
N$74: D68.A SW_N4.1@1(P) SW_N4.1@2(P)
N$76: D66.A SW_QU.1@1(P) SW_QU.1@2(P)
N$77: D65.A SW_CS.1@1(P) SW_CS.1@2(P)
N$78: D64.A SW_L.1@1(P) SW_L.1@2(P)
N$80: D56.A SW_A.1@1(P) SW_A.1@2(P)
N$81: D57.A SW_S.1@1(P) SW_S.1@2(P)
N$82: D58.A SW_D.1@1(P) SW_D.1@2(P)
N$83: D59.A SW_F.1@1(P) SW_F.1@2(P)
N$84: D60.A SW_G.1@1(P) SW_G.1@2(P)
N$85: D61.A SW_H.1@1(P) SW_H.1@2(P)
N$86: D62.A SW_J.1@1(P) SW_J.1@2(P)
N$87: D63.A SW_K.1@1(P) SW_K.1@2(P)
N$88: D72.A SW_Z.1@1(P) SW_Z.1@2(P)
N$89: D73.A SW_X.1@1(P) SW_X.1@2(P)
N$90: D74.A SW_C.1@1(P) SW_C.1@2(P)
N$91: D75.A SW_V.1@1(P) SW_V.1@2(P)
N$92: D76.A SW_B.1@1(P) SW_B.1@2(P)
N$93: D77.A SW_N.1@1(P) SW_N.1@2(P)
N$94: D78.A SW_M.1@1(P) SW_M.1@2(P)
N$95: D79.A SW_CM.1@1(P) SW_CM.1@2(P)
N$96: D80.A SW_DT.1@1(P) SW_DT.1@2(P)
N$97: D81.A SW_FS.1@1(P) SW_FS.1@2(P)
N$98: D82.A SW_RS.1@1(P) SW_RS.1@2(P)
N$99: D83.A SW_UP.1@1(P) SW_UP.1@2(P)
N$100: D84.A SW_N1.1@1(P) SW_N1.1@2(P)
N$101: D85.A SW_N2.1@1(P) SW_N2.1@2(P)
N$102: D98.A SW_N0.1@1(P) SW_N0.1@2(P)
N$103: D97.A SW_RT.1@1(P) SW_RT.1@2(P)
N$104: D96.A SW_DN.1@1(P) SW_DN.1@2(P)
N$105: D95.A SW_LF.1@1(P) SW_LF.1@2(P)
N$106: SW_F17.E U$1.3
N$107: D94.A SW_RC.1@1(P) SW_RC.1@2(P)
N$108: D93.A SW_RW.1@1(P) SW_RW.1@2(P)
N$109: D92.A SW_RA.1@1(P) SW_RA.1@2(P)
N$110: D91.A SW_SPC.1@1(P) SW_SPC.1@2(P)
N$111: D90.A SW_LA.1@1(P) SW_LA.1@2(P)
N$112: D89.A SW_LW.1@1(P) SW_LW.1@2(P)
N$113: D88.A SW_LC.1@1(P) SW_LC.1@2(P)
N$114: D99.A SW_ND.1@1(P) SW_ND.1@2(P)
N$115: D86.A SW_N3.1@1(P) SW_N3.1@2(P)
N$116: D87.A SW_NEN.1@1(P) SW_NEN.1@2(P)
N$117: D54.A SW_NP.1@1(P) SW_NP.1@2(P)
N$118: D53.A SW_N9.1@1(P) SW_N9.1@2(P)
N$119: D36.A SW_MIN.1@1(P) SW_MIN.1@2(P)
N$120: D35.A SW_MUL.1@1(P) SW_MUL.1@2(P)
N$121: D17.A SW_F16.1@1(P) SW_F16.1@2(P)
N$142: SW_F17.D U$1.4
N$144: D101.A JKEY.3
N$152: SW_F17.A U$1.5
N$154: SW_F17.B U$1.6
N$155: SW_F17.C ; supply symbol labelled GND
N$156: D102.A JKEY.5
N$157: D18.A U$2.4
PA0/WKUP: JPWM.3 ; also sheet 1
RESET: D201.3(C) D202.3(C) J1.2 S1.3 S1.4
ROW0: SW_ESC.2@1(S) SW_ESC.2@2(S) SW_F1.2@1(S) SW_F1.2@2(S) SW_F2.2@1(S) SW_F2.2@2(S) SW_F3.2@1(S) SW_F3.2@2(S) SW_F4.2@1(S) SW_F4.2@2(S) SW_F5.2@1(S) SW_F5.2@2(S) SW_F6.2@1(S) SW_F6.2@2(S) SW_F7.2@1(S) SW_F7.2@2(S) SW_F8.2@1(S) SW_F8.2@2(S) SW_F9.2@1(S) SW_F9.2@2(S) SW_F10.2@1(S) SW_F10.2@2(S) SW_F11.2@1(S) SW_F11.2@2(S) SW_F12.2@1(S) SW_F12.2@2(S) SW_F13.2@1(S) SW_F13.2@2(S) SW_F14.2@1(S) SW_F14.2@2(S) SW_F15.2@1(S) SW_F15.2@2(S) SW_F16.2@1(S) SW_F16.2@2(S) U$2.3 ; also sheet 1
ROW1: SW_0.2@1(S) SW_0.2@2(S) SW_1.2@1(S) SW_1.2@2(S) SW_2.2@1(S) SW_2.2@2(S) SW_3.2@1(S) SW_3.2@2(S) SW_4.2@1(S) SW_4.2@2(S) SW_5.2@1(S) SW_5.2@2(S) SW_6.2@1(S) SW_6.2@2(S) SW_7.2@1(S) SW_7.2@2(S) SW_8.2@1(S) SW_8.2@2(S) SW_9.2@1(S) SW_9.2@2(S) SW_BSP.2@1(S) SW_BSP.2@2(S) SW_DSH.2@1(S) SW_DSH.2@2(S) SW_EP.2@1(S) SW_EP.2@2(S) SW_MIN.2@1(S) SW_MIN.2@2(S) SW_MU.2@1(S) SW_MU.2@2(S) SW_MUL.2@1(S) SW_MUL.2@2(S) SW_NUM.2@1(S) SW_NUM.2@2(S) SW_TDL.2@1(S) SW_TDL.2@2(S) ; also sheet 1
ROW2: SW_CB.2@1(S) SW_CB.2@2(S) SW_DP.2@1(S) SW_DP.2@2(S) SW_E.2@1(S) SW_E.2@2(S) SW_I.2@1(S) SW_I.2@2(S) SW_N7.2@1(S) SW_N7.2@2(S) SW_N8.2@1(S) SW_N8.2@2(S) SW_N9.2@1(S) SW_N9.2@2(S) SW_NP.2@1(S) SW_NP.2@2(S) SW_O.2@1(S) SW_O.2@2(S) SW_OB.2@1(S) SW_OB.2@2(S) SW_P.2@1(S) SW_P.2@2(S) SW_Q.2@1(S) SW_Q.2@2(S) SW_R.2@1(S) SW_R.2@2(S) SW_T.2@1(S) SW_T.2@2(S) SW_TAB.2@1(S) SW_TAB.2@2(S) SW_U.2@1(S) SW_U.2@2(S) SW_W.2@1(S) SW_W.2@2(S) SW_Y.2@1(S) SW_Y.2@2(S) ; also sheet 1
ROW3: SW_A.2@1(S) SW_A.2@2(S) SW_CL2.1(P) SW_CL.2@1(S) SW_CL.2@2(S) SW_CS.2@1(S) SW_CS.2@2(S) SW_D.2@1(S) SW_D.2@2(S) SW_ENT.2@1(S) SW_ENT.2@2(S) SW_F.2@1(S) SW_F.2@2(S) SW_G.2@1(S) SW_G.2@2(S) SW_H.2@1(S) SW_H.2@2(S) SW_J.2@1(S) SW_J.2@2(S) SW_K.2@1(S) SW_K.2@2(S) SW_L.2@1(S) SW_L.2@2(S) SW_N4.2@1(S) SW_N4.2@2(S) SW_N5.2@1(S) SW_N5.2@2(S) SW_N6.2@1(S) SW_N6.2@2(S) SW_QU.2@1(S) SW_QU.2@2(S) SW_S.2@1(S) SW_S.2@2(S) ; also sheet 1
ROW4: SW_B.2@1(S) SW_B.2@2(S) SW_C.2@1(S) SW_C.2@2(S) SW_CM.2@1(S) SW_CM.2@2(S) SW_DT.2@1(S) SW_DT.2@2(S) SW_FS.2@1(S) SW_FS.2@2(S) SW_LS.2@1(S) SW_LS.2@2(S) SW_M.2@1(S) SW_M.2@2(S) SW_N1.2@1(S) SW_N1.2@2(S) SW_N2.2@1(S) SW_N2.2@2(S) SW_N3.2@1(S) SW_N3.2@2(S) SW_N.2@1(S) SW_N.2@2(S) SW_NEN.2@1(S) SW_NEN.2@2(S) SW_RS.2@1(S) SW_RS.2@2(S) SW_UP.2@1(S) SW_UP.2@2(S) SW_V.2@1(S) SW_V.2@2(S) SW_X.2@1(S) SW_X.2@2(S) SW_Z.2@1(S) SW_Z.2@2(S) ; also sheet 1
ROW5: JKEY.2 JKEY.4 SW_DN.2@1(S) SW_DN.2@2(S) SW_LA.2@1(S) SW_LA.2@2(S) SW_LC.2@1(S) SW_LC.2@2(S) SW_LF.2@1(S) SW_LF.2@2(S) SW_LW.2@1(S) SW_LW.2@2(S) SW_N0.2@1(S) SW_N0.2@2(S) SW_ND.2@1(S) SW_ND.2@2(S) SW_RA.2@1(S) SW_RA.2@2(S) SW_RC.2@1(S) SW_RC.2@2(S) SW_RT.2@1(S) SW_RT.2@2(S) SW_RW.2@1(S) SW_RW.2@2(S) SW_SPC.2@1(S) SW_SPC.2@2(S) ; also sheet 1
SCK: JSPI.3 ; also sheet 1,3
SCL: JI2C.1 ; also sheet 1,3
SDA: JI2C.2 ; also sheet 1,3
VCC_1: JPWM.1 ; supply symbol labelled 5V ; also sheet 1,3
VCC_2: JI2C.3 JPWM.2 JSPI.2 JTAG.1 R16.1 R17.1 U$2.2 ; supply symbol labelled 3V3 ; also sheet 1,3
Unconnected: JTAG.7 U$1.2 U$1.NC1(M) U$1.NC2(M) U$2.NC1(M) U$2.NC2(M)

### Notes on the sheet
- Optional
  DIP Switch
- DNP
- (Optional)
  DIP_SWITCH_1
- (Optional)
  DIP_SWITCH_1

## Sheet 3 of 3
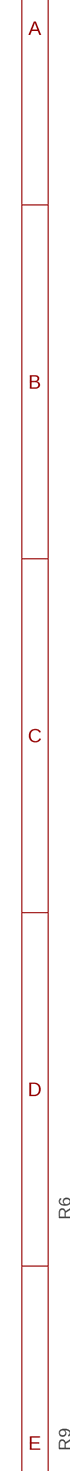
[diagram p2: schematic, sheet 3, part 1 of 2]
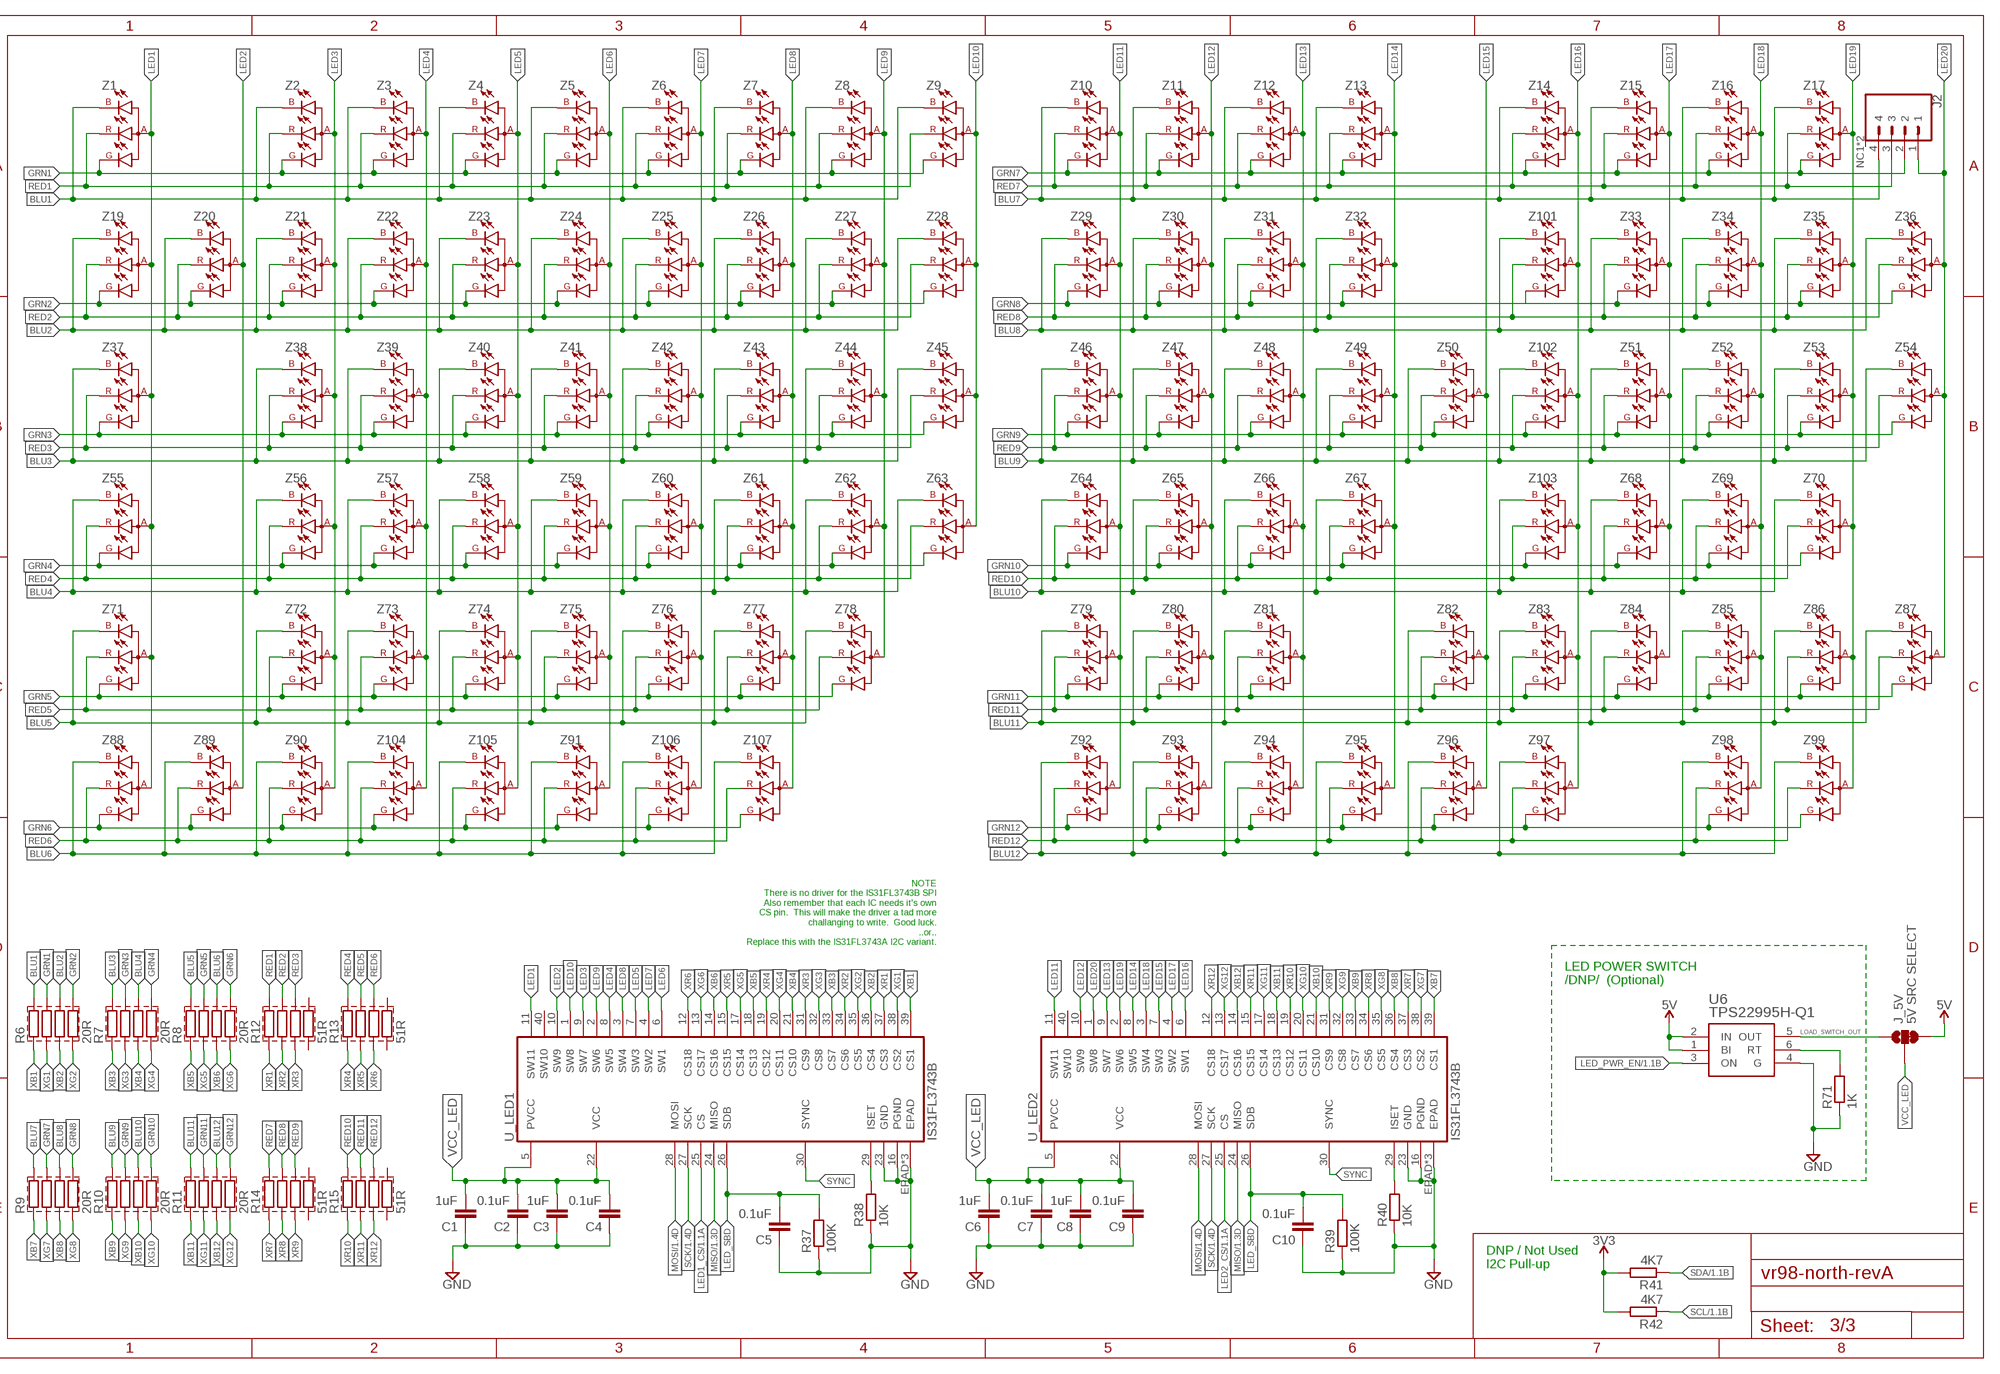
[diagram p3: schematic, sheet 3, part 2 of 2]

### Parts
C1  1uF  C-EUC0603  [C0603]
C2  0.1uF  C-EUC0603  [C0603]
C3  1uF  C-EUC0603  [C0603]
C4  0.1uF  C-EUC0603  [C0603]
C5  0.1uF  C-EUC0603  [C0603]
C6  1uF  C-EUC0603  [C0603]
C7  0.1uF  C-EUC0603  [C0603]
C8  1uF  C-EUC0603  [C0603]
C9  0.1uF  C-EUC0603  [C0603]
C10  0.1uF  C-EUC0603  [C0603]
J2  MOLEX_0781710004  [MOLEX_781710004]
J_5V  5V SRC SELECT  JUMPER-SMT_3_1-NC_TRACE_SILK  [SMT-JUMPER_3_1-NC_TRACE_SILK]
R6  20R  R-EU-4  [R0603X4]
R7  20R  R-EU-4  [R0603X4]
R8  20R  R-EU-4  [R0603X4]
R9  20R  R-EU-4  [R0603X4]
R10  20R  R-EU-4  [R0603X4]
R11  20R  R-EU-4  [R0603X4]
R12  51R  R-EU-4  [R0603X4]
R13  51R  R-EU-4  [R0603X4]
R14  51R  R-EU-4  [R0603X4]
R15  51R  R-EU-4  [R0603X4]
R37  100K  R-EU_R0603  [R0603]
R38  10K  R-EU_R0603  [R0603]
R39  100K  R-EU_R0603  [R0603]
R40  10K  R-EU_R0603  [R0603]
R41  4K7  R-EU_R0603  [R0603]
R42  4K7  R-EU_R0603  [R0603]
R71  1K  R-EU_R0603  [R0603]
U6  TPS22995H-Q1  [SOT-23-THIN-6_DDC_TEX]
U_LED1  IS31FL3743B  [UQFN40]
U_LED2  IS31FL3743B  [UQFN40]
Z1  156120M173000  [156120M173000]
Z2  156120M173000  [156120M173000]
Z3  156120M173000  [156120M173000]
Z4  156120M173000  [156120M173000]
Z5  156120M173000  [156120M173000]
Z6  156120M173000  [156120M173000]
Z7  156120M173000  [156120M173000]
Z8  156120M173000  [156120M173000]
Z9  156120M173000  [156120M173000]
Z10  156120M173000  [156120M173000]
Z11  156120M173000  [156120M173000]
Z12  156120M173000  [156120M173000]
Z13  156120M173000  [156120M173000]
Z14  156120M173000  [156120M173000]
Z15  156120M173000  [156120M173000]
Z16  156120M173000  [156120M173000]
Z17  156120M173000  [156120M173000]
Z19  DNP  156120M173000  [156120M173000]
Z20  156120M173000  [156120M173000]
Z21  156120M173000  [156120M173000]
Z22  156120M173000  [156120M173000]
Z23  156120M173000  [156120M173000]
Z24  156120M173000  [156120M173000]
Z25  156120M173000  [156120M173000]
Z26  156120M173000  [156120M173000]
Z27  156120M173000  [156120M173000]
Z28  156120M173000  [156120M173000]
Z29  156120M173000  [156120M173000]
Z30  156120M173000  [156120M173000]
Z31  156120M173000  [156120M173000]
Z32  156120M173000  [156120M173000]
Z33  156120M173000  [156120M173000]
Z34  156120M173000  [156120M173000]
Z35  156120M173000  [156120M173000]
Z36  156120M173000  [156120M173000]
Z37  156120M173000  [156120M173000]
Z38  156120M173000  [156120M173000]
Z39  156120M173000  [156120M173000]
Z40  156120M173000  [156120M173000]
Z41  156120M173000  [156120M173000]
Z42  156120M173000  [156120M173000]
Z43  156120M173000  [156120M173000]
Z44  156120M173000  [156120M173000]
Z45  156120M173000  [156120M173000]
Z46  156120M173000  [156120M173000]
Z47  156120M173000  [156120M173000]
Z48  156120M173000  [156120M173000]
Z49  156120M173000  [156120M173000]
Z50  156120M173000  [156120M173000]
Z51  156120M173000  [156120M173000]
Z52  156120M173000  [156120M173000]
Z53  156120M173000  [156120M173000]
Z54  156120M173000  [156120M173000]
Z55  156120M173000  [156120M173000]
Z56  156120M173000  [156120M173000]
Z57  156120M173000  [156120M173000]
Z58  156120M173000  [156120M173000]
Z59  156120M173000  [156120M173000]
Z60  156120M173000  [156120M173000]
Z61  156120M173000  [156120M173000]
Z62  156120M173000  [156120M173000]
Z63  156120M173000  [156120M173000]
Z64  156120M173000  [156120M173000]
Z65  156120M173000  [156120M173000]
Z66  156120M173000  [156120M173000]
Z67  156120M173000  [156120M173000]
Z68  156120M173000  [156120M173000]
Z69  156120M173000  [156120M173000]
Z70  156120M173000  [156120M173000]
Z71  156120M173000  [156120M173000]
Z72  156120M173000  [156120M173000]
Z73  156120M173000  [156120M173000]
Z74  156120M173000  [156120M173000]
Z75  156120M173000  [156120M173000]
Z76  156120M173000  [156120M173000]
Z77  156120M173000  [156120M173000]
Z78  156120M173000  [156120M173000]
Z79  156120M173000  [156120M173000]
Z80  156120M173000  [156120M173000]
Z81  156120M173000  [156120M173000]
Z82  156120M173000  [156120M173000]
Z83  156120M173000  [156120M173000]
Z84  156120M173000  [156120M173000]
Z85  156120M173000  [156120M173000]
Z86  156120M173000  [156120M173000]
Z87  156120M173000  [156120M173000]
Z88  156120M173000  [156120M173000]
Z89  156120M173000  [156120M173000]
Z90  156120M173000  [156120M173000]
Z91  156120M173000  [156120M173000]
Z92  156120M173000  [156120M173000]
Z93  156120M173000  [156120M173000]
Z94  156120M173000  [156120M173000]
Z95  156120M173000  [156120M173000]
Z96  156120M173000  [156120M173000]
Z97  156120M173000  [156120M173000]
Z98  156120M173000  [156120M173000]
Z99  156120M173000  [156120M173000]
Z101  156120M173000  [156120M173000]
Z102  156120M173000  [156120M173000]
Z103  156120M173000  [156120M173000]
Z104  156120M173000  [156120M173000]
Z105  156120M173000  [156120M173000]
Z106  156120M173000  [156120M173000]
Z107  156120M173000  [156120M173000]

### Nets
BLU1: R6.8 Z1.2(B) Z2.2(B) Z3.2(B) Z4.2(B) Z5.2(B) Z6.2(B) Z7.2(B) Z8.2(B) Z9.2(B)
BLU2: R6.6 Z19.2(B) Z20.2(B) Z21.2(B) Z22.2(B) Z23.2(B) Z24.2(B) Z25.2(B) Z26.2(B) Z27.2(B) Z28.2(B)
BLU3: R7.8 Z37.2(B) Z38.2(B) Z39.2(B) Z40.2(B) Z41.2(B) Z42.2(B) Z43.2(B) Z44.2(B) Z45.2(B)
BLU4: R7.6 Z55.2(B) Z56.2(B) Z57.2(B) Z58.2(B) Z59.2(B) Z60.2(B) Z61.2(B) Z62.2(B) Z63.2(B)
BLU5: R8.8 Z71.2(B) Z72.2(B) Z73.2(B) Z74.2(B) Z75.2(B) Z76.2(B) Z77.2(B) Z78.2(B)
BLU6: R8.6 Z88.2(B) Z89.2(B) Z90.2(B) Z91.2(B) Z104.2(B) Z105.2(B) Z106.2(B) Z107.2(B)
BLU7: J2.4 R9.8 Z10.2(B) Z11.2(B) Z12.2(B) Z13.2(B) Z14.2(B) Z15.2(B) Z16.2(B) Z17.2(B)
BLU8: R9.6 Z29.2(B) Z30.2(B) Z31.2(B) Z32.2(B) Z33.2(B) Z34.2(B) Z35.2(B) Z36.2(B) Z101.2(B)
BLU9: R10.8 Z46.2(B) Z47.2(B) Z48.2(B) Z49.2(B) Z50.2(B) Z51.2(B) Z52.2(B) Z53.2(B) Z54.2(B) Z102.2(B)
BLU10: R10.6 Z64.2(B) Z65.2(B) Z66.2(B) Z67.2(B) Z68.2(B) Z69.2(B) Z70.2(B) Z103.2(B)
BLU11: R11.8 Z79.2(B) Z80.2(B) Z81.2(B) Z82.2(B) Z83.2(B) Z84.2(B) Z85.2(B) Z86.2(B) Z87.2(B)
BLU12: R11.6 Z92.2(B) Z93.2(B) Z94.2(B) Z95.2(B) Z96.2(B) Z97.2(B) Z98.2(B) Z99.2(B)
GND: C1.1 C2.1 C3.1 C4.1 C5.1 C6.1 C7.1 C8.1 C9.1 C10.1 R37.1 R38.1 R39.1 R40.1 R71.1 U6.4(G) U_LED1.16(PGND) U_LED1.23(GND) U_LED1.EPAD U_LED1.EPAD@1(EPAD) U_LED1.EPAD@2(EPAD) U_LED2.16(PGND) U_LED2.23(GND) U_LED2.EPAD U_LED2.EPAD@1(EPAD) U_LED2.EPAD@2(EPAD) ; also sheet 1,2
GRN1: R6.7 Z1.4(G) Z2.4(G) Z3.4(G) Z4.4(G) Z5.4(G) Z6.4(G) Z7.4(G) Z8.4(G) Z9.4(G)
GRN2: R6.5 Z19.4(G) Z20.4(G) Z21.4(G) Z22.4(G) Z23.4(G) Z24.4(G) Z25.4(G) Z26.4(G) Z27.4(G) Z28.4(G)
GRN3: R7.7 Z37.4(G) Z38.4(G) Z39.4(G) Z40.4(G) Z41.4(G) Z42.4(G) Z43.4(G) Z44.4(G) Z45.4(G)
GRN4: R7.5 Z55.4(G) Z56.4(G) Z57.4(G) Z58.4(G) Z59.4(G) Z60.4(G) Z61.4(G) Z62.4(G) Z63.4(G)
GRN5: R8.7 Z71.4(G) Z72.4(G) Z73.4(G) Z74.4(G) Z75.4(G) Z76.4(G) Z77.4(G) Z78.4(G)
GRN6: R8.5 Z88.4(G) Z89.4(G) Z90.4(G) Z91.4(G) Z104.4(G) Z105.4(G) Z106.4(G) Z107.4(G)
GRN7: J2.2 R9.7 Z10.4(G) Z11.4(G) Z12.4(G) Z13.4(G) Z14.4(G) Z15.4(G) Z16.4(G) Z17.4(G)
GRN8: R9.5 Z29.4(G) Z30.4(G) Z31.4(G) Z32.4(G) Z33.4(G) Z34.4(G) Z35.4(G) Z36.4(G) Z101.4(G)
GRN9: R10.7 Z46.4(G) Z47.4(G) Z48.4(G) Z49.4(G) Z50.4(G) Z51.4(G) Z52.4(G) Z53.4(G) Z54.4(G) Z102.4(G)
GRN10: R10.5 Z64.4(G) Z65.4(G) Z66.4(G) Z67.4(G) Z68.4(G) Z69.4(G) Z70.4(G) Z103.4(G)
GRN11: R11.7 Z79.4(G) Z80.4(G) Z81.4(G) Z82.4(G) Z83.4(G) Z84.4(G) Z85.4(G) Z86.4(G) Z87.4(G)
GRN12: R11.5 Z92.4(G) Z93.4(G) Z94.4(G) Z95.4(G) Z96.4(G) Z97.4(G) Z98.4(G) Z99.4(G)
LED1: U_LED1.11(SW11) Z1.1(A) Z19.1(A) Z37.1(A) Z55.1(A) Z71.1(A) Z88.1(A)
LED1_CS: U_LED1.25(CS) ; also sheet 1
LED2: U_LED1.10(SW9) Z20.1(A) Z89.1(A)
LED2_CS: U_LED2.25(CS) ; also sheet 1
LED3: U_LED1.9(SW7) Z2.1(A) Z21.1(A) Z38.1(A) Z56.1(A) Z72.1(A) Z90.1(A)
LED4: U_LED1.8(SW5) Z3.1(A) Z22.1(A) Z39.1(A) Z57.1(A) Z73.1(A) Z104.1(A)
LED5: U_LED1.7(SW3) Z4.1(A) Z23.1(A) Z40.1(A) Z58.1(A) Z74.1(A) Z105.1(A)
LED6: U_LED1.6(SW1) Z5.1(A) Z24.1(A) Z41.1(A) Z59.1(A) Z75.1(A) Z91.1(A)
LED7: U_LED1.4(SW2) Z6.1(A) Z25.1(A) Z42.1(A) Z60.1(A) Z76.1(A) Z106.1(A)
LED8: U_LED1.3(SW4) Z7.1(A) Z26.1(A) Z43.1(A) Z61.1(A) Z77.1(A) Z107.1(A)
LED9: U_LED1.2(SW6) Z8.1(A) Z27.1(A) Z44.1(A) Z62.1(A) Z78.1(A)
LED10: U_LED1.1(SW8) Z9.1(A) Z28.1(A) Z45.1(A) Z63.1(A)
LED11: U_LED2.11(SW11) Z10.1(A) Z29.1(A) Z46.1(A) Z64.1(A) Z79.1(A) Z92.1(A)
LED12: U_LED2.10(SW9) Z11.1(A) Z30.1(A) Z47.1(A) Z65.1(A) Z80.1(A) Z93.1(A)
LED13: U_LED2.9(SW7) Z12.1(A) Z31.1(A) Z48.1(A) Z66.1(A) Z81.1(A) Z94.1(A)
LED14: U_LED2.8(SW5) Z13.1(A) Z32.1(A) Z49.1(A) Z67.1(A) Z95.1(A)
LED15: U_LED2.7(SW3) Z50.1(A) Z82.1(A) Z96.1(A)
LED16: U_LED2.6(SW1) Z14.1(A) Z83.1(A) Z97.1(A) Z101.1(A) Z102.1(A) Z103.1(A)
LED17: U_LED2.4(SW2) Z15.1(A) Z33.1(A) Z51.1(A) Z68.1(A) Z84.1(A)
LED18: U_LED2.3(SW4) Z16.1(A) Z34.1(A) Z52.1(A) Z69.1(A) Z85.1(A) Z98.1(A)
LED19: U_LED2.2(SW6) Z17.1(A) Z35.1(A) Z53.1(A) Z70.1(A) Z86.1(A) Z99.1(A)
LED20: J2.1 U_LED2.1(SW8) Z36.1(A) Z54.1(A) Z87.1(A)
LED_PWR_EN: U6.3(ON) ; also sheet 1
LED_SBD: C5.2 C10.2 R37.2 R39.2 U_LED1.26(SDB) U_LED2.26(SDB)
LOAD_SWITCH_OUT: J_5V.1 U6.5(OUT)
MISO: U_LED1.24(MISO) U_LED2.24(MISO) ; also sheet 1,2
MOSI: U_LED1.28(MOSI) U_LED2.28(MOSI) ; also sheet 1,2
N$135: R71.2 U6.6(RT)
N$136: R38.2 U_LED1.29(ISET)
N$151: R40.2 U_LED2.29(ISET)
RED1: R12.8 Z1.3(R) Z2.3(R) Z3.3(R) Z4.3(R) Z5.3(R) Z6.3(R) Z7.3(R) Z8.3(R) Z9.3(R)
RED2: R12.7 Z19.3(R) Z20.3(R) Z21.3(R) Z22.3(R) Z23.3(R) Z24.3(R) Z25.3(R) Z26.3(R) Z27.3(R) Z28.3(R)
RED3: R12.6 Z37.3(R) Z38.3(R) Z39.3(R) Z40.3(R) Z41.3(R) Z42.3(R) Z43.3(R) Z44.3(R) Z45.3(R)
RED4: R13.8 Z55.3(R) Z56.3(R) Z57.3(R) Z58.3(R) Z59.3(R) Z60.3(R) Z61.3(R) Z62.3(R) Z63.3(R)
RED5: R13.7 Z71.3(R) Z72.3(R) Z73.3(R) Z74.3(R) Z75.3(R) Z76.3(R) Z77.3(R) Z78.3(R)
RED6: R13.6 Z88.3(R) Z89.3(R) Z90.3(R) Z91.3(R) Z104.3(R) Z105.3(R) Z106.3(R) Z107.3(R)
RED7: J2.3 R14.8 Z10.3(R) Z11.3(R) Z12.3(R) Z13.3(R) Z14.3(R) Z15.3(R) Z16.3(R) Z17.3(R)
RED8: R14.7 Z29.3(R) Z30.3(R) Z31.3(R) Z32.3(R) Z33.3(R) Z34.3(R) Z35.3(R) Z36.3(R) Z101.3(R)
RED9: R14.6 Z46.3(R) Z47.3(R) Z48.3(R) Z49.3(R) Z50.3(R) Z51.3(R) Z52.3(R) Z53.3(R) Z54.3(R) Z102.3(R)
RED10: R15.8 Z64.3(R) Z65.3(R) Z66.3(R) Z67.3(R) Z68.3(R) Z69.3(R) Z70.3(R) Z103.3(R)
RED11: R15.7 Z79.3(R) Z80.3(R) Z81.3(R) Z82.3(R) Z83.3(R) Z84.3(R) Z85.3(R) Z86.3(R) Z87.3(R)
RED12: R15.6 Z92.3(R) Z93.3(R) Z94.3(R) Z95.3(R) Z96.3(R) Z97.3(R) Z98.3(R) Z99.3(R)
SCK: U_LED1.27(SCK) U_LED2.27(SCK) ; also sheet 1,2
SCL: R42.1 ; also sheet 1,2
SDA: R41.1 ; also sheet 1,2
SYNC: U_LED1.30(SYNC) U_LED2.30(SYNC)
VCC_1: J_5V.3 U6.1(BI) U6.2(IN) ; supply symbol labelled 5V ; also sheet 1,2
VCC_2: R41.2 R42.2 ; supply symbol labelled 3V3 ; also sheet 1,2
VCC_LED: C1.2 C2.2 C3.2 C4.2 C6.2 C7.2 C8.2 C9.2 J_5V.2 U_LED1.5(PVCC) U_LED1.22(VCC) U_LED2.5(PVCC) U_LED2.22(VCC)
XB1: R6.1 U_LED1.39(CS1)
XB2: R6.3 U_LED1.36(CS4)
XB3: R7.1 U_LED1.33(CS7)
XB4: R7.3 U_LED1.21(CS10)
XB5: R8.1 U_LED1.18(CS13)
XB6: R8.3 U_LED1.14(CS16)
XB7: R9.1 U_LED2.39(CS1)
XB8: R9.3 U_LED2.36(CS4)
XB9: R10.1 U_LED2.33(CS7)
XB10: R10.3 U_LED2.21(CS10)
XB11: R11.1 U_LED2.18(CS13)
XB12: R11.3 U_LED2.14(CS16)
XG1: R6.2 U_LED1.38(CS2)
XG2: R6.4 U_LED1.35(CS5)
XG3: R7.2 U_LED1.32(CS8)
XG4: R7.4 U_LED1.20(CS11)
XG5: R8.2 U_LED1.17(CS14)
XG6: R8.4 U_LED1.13(CS17)
XG7: R9.2 U_LED2.38(CS2)
XG8: R9.4 U_LED2.35(CS5)
XG9: R10.2 U_LED2.32(CS8)
XG10: R10.4 U_LED2.20(CS11)
XG11: R11.2 U_LED2.17(CS14)
XG12: R11.4 U_LED2.13(CS17)
XR1: R12.1 U_LED1.37(CS3)
XR2: R12.2 U_LED1.34(CS6)
XR3: R12.3 U_LED1.31(CS9)
XR4: R13.1 U_LED1.19(CS12)
XR5: R13.2 U_LED1.15(CS15)
XR6: R13.3 U_LED1.12(CS18)
XR7: R14.1 U_LED2.37(CS3)
XR8: R14.2 U_LED2.34(CS6)
XR9: R14.3 U_LED2.31(CS9)
XR10: R15.1 U_LED2.19(CS12)
XR11: R15.2 U_LED2.15(CS15)
XR12: R15.3 U_LED2.12(CS18)
Unconnected: J2.NC1(M) J2.NC2(M) R12.4 R12.5 R13.4 R13.5 R14.4 R14.5 R15.4 R15.5 U_LED1.40(SW10) U_LED2.40(SW10)

### Notes on the sheet
- NOTE
  There is no driver for the IS31FL3743B SPI
  Also remember that each IC needs it's own
  CS pin.  This will make the driver a tad more
  challanging to write.  Good luck.
  ..or..
  Replace this with the IS31FL3743A I2C variant.
- LED POWER SWITCH
  /DNP/  (Optional)
- DNP / Not Used
  I2C Pull-up

## Library data of the parts
C1-C19 C29 C30 = rcl:C-EU: CAPACITOR, European symbol; SPICEPREFIX: C
C20 C21 C25-C28 = SparkFun-Capacitors:0.1UF: 0.1µF ceramic capacitors A capacitor is a passive two-terminal electrical component used to store electrical energy temporarily in an electric field.; PROD_ID: CAP-08604; VALUE: 0.1uF
C22 C23 = SparkFun-Capacitors:0.22UF: 0.22µF ceramic capacitors A capacitor is a passive two-terminal electrical component used to store electrical energy temporarily in an electric field.; PROD_ID: CAP-07822; VALUE: 0.22uF
C24 = SparkFun-Capacitors:1.0NF/1000PF: 1nF/1,000pF ceramic capacitors A capacitor is a passive two-terminal electrical component used to store electrical energy temporarily in an electric field.; PROD_ID: CAP-07886; VALUE: 1nF
D00 D1-D99 D101 D102 = jlcpcb_basic_parts:1N5819WS: JLCPCB Part # C8598 Description 40V 600mV@1A 1A SOD-123 Schottky Barrier Diodes (SBD) ROHS Schottky Diode
D107 = SparkFun-LED:LED-BLUE: Blue SMD LED Used in manufacturing of various products at SparkFun Packages: 0603 - SMD 0603 package [Product Link] <http://www.digikey.com/product-detail/en/SMLE12BC7TT86/511-1589-2-ND/1641808> 1206 - SMD1206 package [Product Link] <http://www.digikey.com/product-detail/en/lite-on-inc/LTST-C150TBKT/160-1643-1-ND/573584> SparkFun Products: ESP8266 Thing-Dev Board <https://www.sparkfun.com/products/13711> RedBoard <https://www.sparkfun.com/products/12757>; PROD_ID: DIO-08575
D201 D202 = adafruit:DIODE: Diode SMADIODE - SMA Surface Mount Package 20V 1A Schottky Diode Digikey: 641-1014-6-ND DO-1N4148 - Through Hole Small Current Diode SOD-123 20V 1 A (.5mV Vf) Schottky Diode - Digikey: MBRX120TPMSCT-ND SOD-323 10V 570mA (.38mV Vf, 3ns) Schottky Diode - Digikey: ZLLS410CT-ND SOD-523 30V 30mA Schottky Diode (RB751S-40TE61) - Digikey: RB751S-40TE61CT-ND SOT23-R/W - SOT23 Package (R = Solder Paste/Reflow Ovens, W = Hand-Soldering) BAT54Film 40V 300mA - Digikey: 497-7162-1-ND
H_BSP H_ENT H_LS H_NEN H_NP H_RS = ts_keyboards:MX-STABS-200U
H_SPC = ts_keyboards:MX-STABS-625U
J1 = SparkFun-Connectors:CONN_02: Multi connection point. Often used as Generic Header-pin footprint for 0.1 inch spaced/style header connections On any of the 0.1 inch spaced packages, you can populate with these: Break Away Headers - Straight <https://www.sparkfun.com/products/116> (PRT-00116) Break Away Male Headers - Right Angle <https://www.sparkfun.com/products/553> (PRT-00553) Female Headers <https://www.sparkfun.com/products/115> (PRT-00115) Break Away Headers - Machine Pin <https://www.sparkfun.com/products/117> (PRT-00117) Break Away Female Headers - Swiss Machine Pin <https://www.sparkfun.com/products/743> (PRT-00743) For SCREWTERMINALS and SPRING TERMINALS visit here: Screw Terimnals on SparkFun.com <https://www.sparkfun.com/search/results?term=Screw+Terminals> (5mm/3.5mm/2.54mm spacing) This device is also useful as a general connection point to wire up your design to another part of your project. Our various solder wires solder well into these plated through hole pads. Hook-Up Wire - Assortment (Stranded, 22 AWG) <https://www.sparkfun.com/products/11375> (PRT-11375) Hook-Up Wire - Assortment (Solid Core, 22 AWG) <https://www.sparkfun.com/products/11367> (PRT-11367) View the entire wire category on our website here <https://www.sparkfun.com/categories/141> Special notes: Molex polarized connector foot print use with: PRT-08233 with associated crimp pins and housings. 2.54_SCREWTERM for use with PRT-10571. 3.5mm Screw Terminal footprints for PRT-08084 5mm Screw Terminal footprints for use with PRT-08432
J2 = molex-pico-ezmate:MOLEX_0781710004: SMD 1.2mm pitch Molex Pico-EZmate 4P connector
J_5V = SparkFun-Jumpers:JUMPER-SMT_3_1-NC_TRACE: Normally closed trace jumper (1 of 2 connections) This jumper has a trace between two pads so it's normally closed (NC). The other connection is normally open (NO). Use a razor knife to open the connection. For best results follow the IPC guidelines for cutting traces: Cutout at least 0.063 mm (0.005 in). Remove all loose material to clean up the cut area. Seal the cut with an approved epoxy. Reapply solder to reclose the connection, or to close the NO connection.
JI2C JPWM = SparkFun-Connectors:CONN_04: Multi connection point. Often used as Generic Header-pin footprint for 0.1 inch spaced/style header connections On any of the 0.1 inch spaced packages, you can populate with these: Break Away Headers - Straight <https://www.sparkfun.com/products/116> (PRT-00116) Break Away Male Headers - Right Angle <https://www.sparkfun.com/products/553> (PRT-00553) Female Headers <https://www.sparkfun.com/products/115> (PRT-00115) Break Away Headers - Machine Pin <https://www.sparkfun.com/products/117> (PRT-00117) Break Away Female Headers - Swiss Machine Pin <https://www.sparkfun.com/products/743> (PRT-00743) For SCREWTERMINALS and SPRING TERMINALS visit here: Screw Terimnals on SparkFun.com <https://www.sparkfun.com/search/results?term=Screw+Terminals> (5mm/3.5mm/2.54mm spacing) This device is also useful as a general connection point to wire up your design to another part of your project. Our various solder wires solder well into these plated through hole pads. Hook-Up Wire - Assortment (Stranded, 22 AWG) <https://www.sparkfun.com/products/11375> (PRT-11375) Hook-Up Wire - Assortment (Solid Core, 22 AWG) <https://www.sparkfun.com/products/11367> (PRT-11367) View the entire wire category on our website here <https://www.sparkfun.com/categories/141> Special notes: Molex polarized connector foot print use with SKU : PRT-08231 with associated crimp pins and housings. 1MM SMD Version SKU: PRT-10208; PROD_ID: CONN-09696
JKEY = molex-pico-ezmate:MOLEX_0781710005
JSPI = SparkFun-Connectors:AVR_SPI_PROG_3X2: AVR ISP 6 Pin This is the reduced ISP connector for AVR programming. Common on Arduino. This footprint will take up less PCB space and can be used with a 10-pin to 6-pin adapter such as SKU: BOB-08508 **Special note about "TEST_POINT" package. The stop mask is on the top side, so if you want your programming test points to be on the bottom of your board, make sure to place this package on the bottom side of the board. This also ensure that the orientation to program from the bottom side will be correct. SparkFun Products: SparkFun ISP Pogo Adapter <https://www.sparkfun.com/products/11591> - NS Tiny AVR Programmer <https://www.sparkfun.com/products/11801> -PTH
JSPI@2 = SparkFun-Connectors:CONN_01: Single connection point. Often used as Generic Header-pin footprint for 0.1 inch spaced/style header connections On any of the 0.1 inch spaced packages, you can populate with these: Break Away Headers - Straight <https://www.sparkfun.com/products/116> (PRT-00116) Break Away Male Headers - Right Angle <https://www.sparkfun.com/products/553> (PRT-00553) Female Headers <https://www.sparkfun.com/products/115> (PRT-00115) Break Away Headers - Machine Pin <https://www.sparkfun.com/products/117> (PRT-00117) Break Away Female Headers - Swiss Machine Pin <https://www.sparkfun.com/products/743> (PRT-00743) This device is also useful as a general connection point to wire up your design to another part of your project. Our various solder wires solder well into these plated through hole pads. Hook-Up Wire - Assortment (Stranded, 22 AWG) <https://www.sparkfun.com/products/11375> (PRT-11375) Hook-Up Wire - Assortment (Solid Core, 22 AWG) <https://www.sparkfun.com/products/11367> (PRT-11367) View the entire wire category on our website here <https://www.sparkfun.com/categories/141> Special notes: SMTSO-256-ET is a "flush mount" nut for a 4-40 screw. We mostly use this on specialty testbeds; it is a nice way to connect hardware to your PCB at an adjustable hieght. Also note, the SNAP packages are for using a snappable style connector. We sell a baggie of snaps and they are also used on two LilyPad designs: Snap Assortment - 30 pack (male and female) <https://www.sparkfun.com/products/11347> (DEV-11347) LilyPad Arduino SimpleSnap <https://www.sparkfun.com/products/10941> (DEV-10941) LilyPad SimpleSnap Protoboard <https://www.sparkfun.com/products/10940> (DEV-10940)
JTAG = SparkFun-Connectors:CONN_05X2: Multi connection point. Often used as Generic Header-pin footprint for 0.1 inch spaced/style header connections For AVR SPI programming port, see special device with nice symbol: "AVR_SPI_PROG_5x2.dev" You can populate with any combo of single row headers, but if you'd like an exact match, check these: 2x5 AVR ICSP Male Header <https://www.sparkfun.com/products/778> (PRT-00778) 2x5 Pin Shrouded Header <https://www.sparkfun.com/products/8506> (PRT-08506) On any of the 0.1 inch spaced packages, you can populate with these: Break Away Headers - Straight <https://www.sparkfun.com/products/116> (PRT-00116) Break Away Male Headers - Right Angle <https://www.sparkfun.com/products/553> (PRT-00553) Female Headers <https://www.sparkfun.com/products/115> (PRT-00115) Break Away Headers - Machine Pin <https://www.sparkfun.com/products/117> (PRT-00117) Break Away Female Headers - Swiss Machine Pin <https://www.sparkfun.com/products/743> (PRT-00743) Special note: the shrouded connector mates well with our 5x2 ribbon cables: 2x5 Pin IDC Ribbon Cable <https://www.sparkfun.com/products/8535> (PRT-08535)
L1 = rcl:L-US: INDUCTOR, American symbol; SPICEPREFIX: L
LM1117 = SparkFun-IC-Power:V_REG_LM1117: Voltage Regulator LM1117 Standard adjustable voltage regulator but in SMD form. Spark Fun Electronics SKU : COM-00595; PROD_ID: VREG-08170
Q1 = adafruit:MOSFET-N: N-Channel Mosfet 2N7002E - 60V 260mA SOT23 [Digikey: 2N7002ET1GOSTR-ND] - REEL BSH103 - 30V 850mA SOT23 [Digikey: 568-5013-1-ND]
Q2 = SparkFun-DiscreteSemi:MOSFET_PCH: P-channel MOSFETs Voltage controlled devices that allow control of high current outputs. SparkFun Products: SparkFun ESP32 Thing <https://www.sparkfun.com/products/13907> SparkFun ESP8266 Thing <https://www.sparkfun.com/products/13231> SparkFun Pi Servo HAT V2 <https://www.sparkfun.com/products/15316> DMG2305UX-7 (20V/4.2A/SOT23-3); PROD_ID: TRAN-14388; VALUE: 20V/4.2A/52mΩ/1.4W
R1-R15 = ts_keyboards:R-EU-4
R16 R17 R37-R42 R45 R46 R65-R71 = rcl:R-EU_: RESISTOR, European symbol; SPICEPREFIX: R
S1 = SparkFun-Switches:MOMENTARY-SWITCH-SPST: Momentary Switch (Pushbutton) - SPST Normally-open (NO) SPST momentary switches (buttons, pushbuttons). Variants PTH-12MM - 12mm square, through-hole Momentary Pushbutton Switch - 12mm Square <https://www.sparkfun.com/products/9190> (COM-09190) PTH-6.0MM, PTH-6.0MM-KIT - 6.0mm square, through-hole Mini Pushbutton Switch <https://www.sparkfun.com/products/97> (COM-00097) KIT package intended for soldering kit's - only one side of pads' copper is exposed. PTH-RIGHT-ANGLE-KIT - Right-angle, through-hole Right Angle Tactile Button <https://www.sparkfun.com/products/10791> - Used on SparkFun BigTime Watch Kit <https://www.sparkfun.com/products/11734> SMD-12MM - 12mm square, surface-mount Tactile Button - SMD (12mm) <https://www.sparkfun.com/products/12993> (COM-12993) Used on SparkFun PicoBoard <https://www.sparkfun.com/products/11888> SMD-4.5MM - 4.5mm Square Trackball Switch Used on SparkFun Blackberry Trackballer Breakout <https://www.sparkfun.com/products/13169> SMD-4.6MMX2.8MM - 4.60mm x 2.80mm, surface mount Used on SparkFun SAMD21 Mini Breakout <https://www.sparkfun.com/products/13664> SMD-5.2MM, SMD-5.2-REDUNDANT - 5.2mm square, surface-mount Mini Pushbutton Switch - SMD <https://www.sparkfun.com/products/8720> (COM-08720) Used on Arduino Pro Mini <https://www.sparkfun.com/products/11114> REDUNDANT package connects both switch circuits together SMD-6.0X3.5MM - 6.0 x 3.5mm, surface mount Momentary Reset Switch SMD <https://www.sparkfun.com/products/8229> (COM-08229) SMD-6.2MM-TALL - 6.2mm square, surface mount Tactile Button - SMD (6mm) <https://www.sparkfun.com/products/12992> Used on SparkFun Digital Sandbox <https://www.sparkfun.com/products/12651> SMD-RIGHT-ANGLE - Right-angle, surface mount Used on SparkFun Block for Intel® Edison - Arduino <https://www.sparkfun.com/products/13036>; PROD_ID: SWCH-14139
SW_0 SW_1-SW_9 SW_A SW_B SW_BSP SW_C SW_CB SW_CL SW_CM SW_CS SW_D SW_DN SW_DP SW_DSH SW_DT SW_E SW_ENT SW_EP SW_ESC SW_F SW_F1-SW_F16 SW_FS SW_G SW_H SW_I SW_J SW_K SW_L SW_LA SW_LC SW_LF SW_LS SW_LW SW_M SW_MIN SW_MU SW_MUL SW_N SW_N0 SW_N1-SW_N9 SW_ND SW_NEN SW_NP SW_NUM SW_O SW_OB SW_P SW_Q SW_QU SW_R SW_RA SW_RC SW_RS SW_RT SW_RW SW_S SW_SPC SW_T SW_TAB SW_TDL SW_U SW_UP SW_V SW_W SW_X SW_Y SW_Z = ts_keyboards:MX-5-PIN-HOTSWAP-PAD
SW_CL2 = ts_keyboards:MX-5-PIN-MILMAX-3305-X
SW_F17 = ts_keyboards:EC11E15244B2; COPYRIGHT: Copyright (C) 2023 Ultra Librarian. All rights reserved.; MANUFACTURER_PART_NUMBER: EC11E15244B2; MFR_NAME: Alps Electric
U1 = st:STM32F411CEU7
U2-U4 = __untitled:74HC589A_DT
U5 = ts_kb_mcu:M25C
U6 = __untitled:TPS22995H-Q1; COPYRIGHT: Copyright (C) 2023 Ultra Librarian. All rights reserved.; MANUFACTURER_PART_NUMBER: TPS22995HQDDCRQ1; MFR_NAME: Texas Instruments; TYPE: Power Management
U$1 U$2 = molex-pico-ezmate:MOLEX_0781710006
U_LED1 U_LED2 = ts_kb_mcu:IS31FL3743B
UDB1 = ts_keyboards:UBD-S1_C4: SMD 1.2mm pitch Molex Pico-EZmate 4P connector
UDB2 = ts_keyboards:UBD-C3: SMD 1mm pitch JST SH 4P connector
Y1 = SparkFun-Clocks:CRYSTAL-32.768KHZ: 32.768kHz Crystal Frequency: 32.768kHz Frequency Stability: ±20ppm Load Capacitance: 12.5pF (PTH-2X6 & SMD-3.2X1.5), 6pF (SMD-2X6) SparkFun Products: SparkFun BigTime Watch Kit <https://www.sparkfun.com/products/11734> SparkFun nRF52832 Breakout <https://www.sparkfun.com/products/13990> SparkFun Real Time Clock Module <https://www.sparkfun.com/products/12708>; PROD_ID: XTAL-13062; VALUE: 32.768kHz
Y2 = SparkFun-Clocks:CRYSTAL-24MHZ: 24MHz Crystal Datasheet <http://www.sparkfun.com/datasheets/Components/AT-SMD-5x3.pdf> Frequency: 24MHz Frequency Tolerance: ±20ppm Load Capacitance: 12pF SparkFun Products: USB Bit Whacker <https://www.sparkfun.com/products/762>; PROD_ID: XTAL-08298; SF_ID: COM-08581; VALUE: 24MHz
Z1-Z17 Z19-Z99 Z101-Z107 = ts_keyboards:156120M173000